# EAGLE design FPGA-ArduinoR3 (EAGLE 9.4.2)

## Sheet 1 of 5
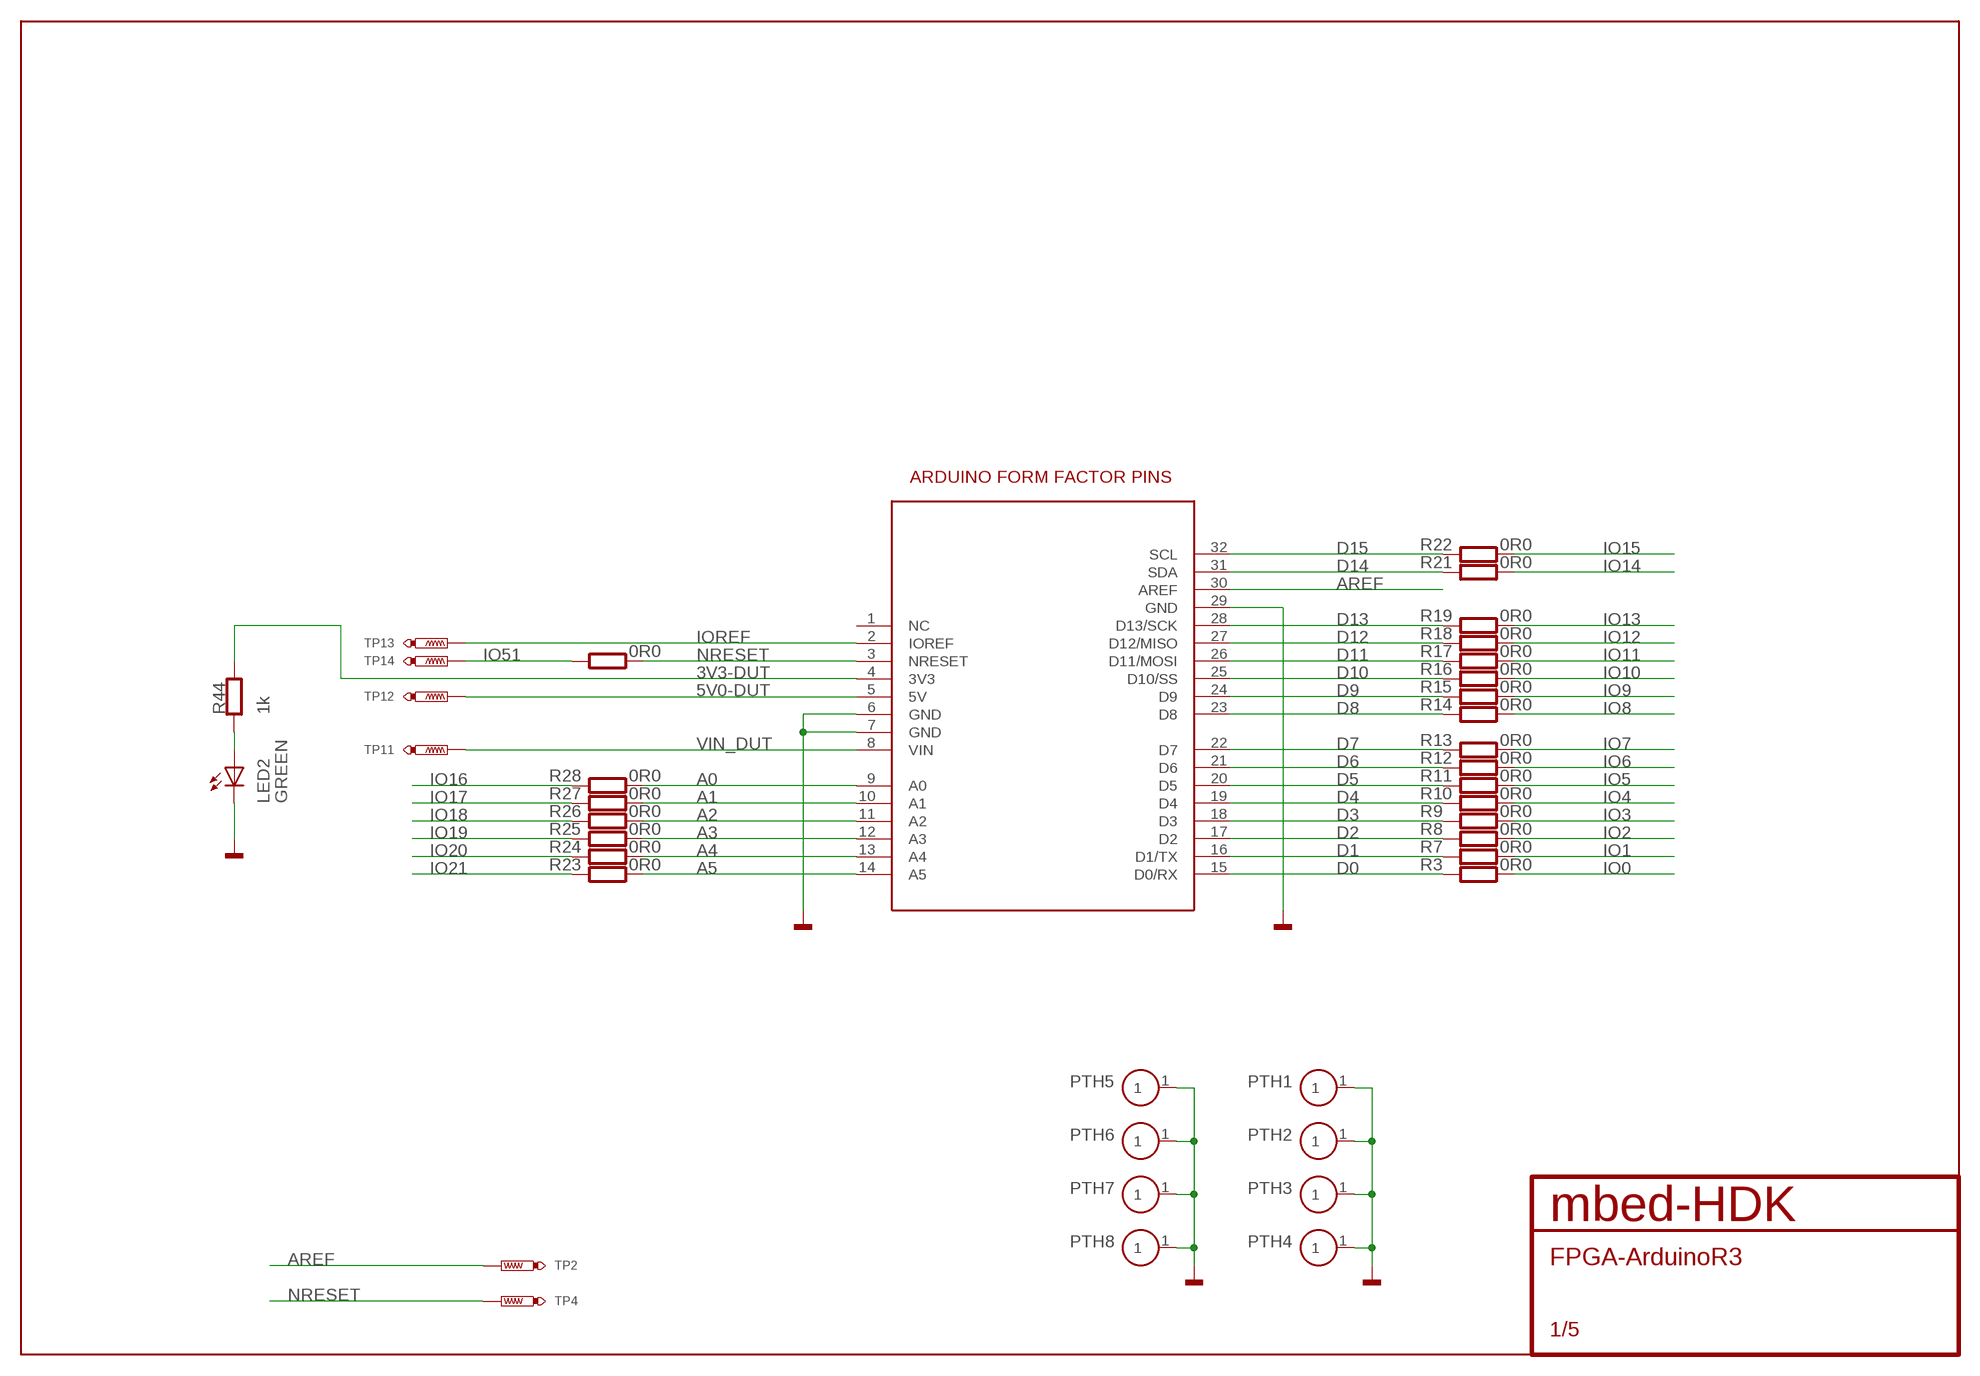
[diagram p0: schematic, sheet 1]

### Parts
BRD1  ARDUINO-R3_SILK  [ARDUINO-R3-SILK]
LED2  GREEN  LED0603  [CHIPLED_0603]
PTH1  FIXINGHOLE  [PTH-140-300]
PTH2  FIXINGHOLE  [PTH-140-300]
PTH3  FIXINGHOLE  [PTH-140-300]
PTH4  FIXINGHOLE  [PTH-140-300]
PTH5  FIXINGHOLE  [PTH-140-300]
PTH6  FIXINGHOLE  [PTH-140-300]
PTH7  FIXINGHOLE  [PTH-140-300]
PTH8  FIXINGHOLE  [PTH-140-300]
R2  0R0  R0603  [0603]
R3  0R0  R0603  [0603]
R7  0R0  R0603  [0603]
R8  0R0  R0603  [0603]
R9  0R0  R0603  [0603]
R10  0R0  R0603  [0603]
R11  0R0  R0603  [0603]
R12  0R0  R0603  [0603]
R13  0R0  R0603  [0603]
R14  0R0  R0603  [0603]
R15  0R0  R0603  [0603]
R16  0R0  R0603  [0603]
R17  0R0  R0603  [0603]
R18  0R0  R0603  [0603]
R19  0R0  R0603  [0603]
R21  0R0  R0603  [0603]
R22  0R0  R0603  [0603]
R23  0R0  R0603  [0603]
R24  0R0  R0603  [0603]
R25  0R0  R0603  [0603]
R26  0R0  R0603  [0603]
R27  0R0  R0603  [0603]
R28  0R0  R0603  [0603]
R44  1k  R0603  [0603]
TP2  TEST_POINT-50R-SMD  [TP50-SMD]
TP4  TEST_POINT-50R-SMD  [TP50-SMD]
TP11  TEST_POINT-50R-SMD  [TP50-SMD]
TP12  TEST_POINT-50R-SMD  [TP50-SMD]
TP13  TEST_POINT-50R-SMD  [TP50-SMD]
TP14  TEST_POINT-50R-SMD  [TP50-SMD]

### Nets
3V3-DUT: BRD1.4(3V3) R44.2
5V0-DUT: BRD1.5(5V) TP12.TP
A0: BRD1.9(A0) R28.1
A1: BRD1.10(A1) R27.1
A2: BRD1.11(A2) R26.1
A3: BRD1.12(A3) R25.1
A4: BRD1.13(A4) R24.1
A5: BRD1.14(A5) R23.1
AREF: BRD1.30(AREF) TP2.TP
D0: BRD1.15(D0/RX) R3.2
D1: BRD1.16(D1/TX) R7.2
D2: BRD1.17(D2) R8.2
D3: BRD1.18(D3) R9.2
D4: BRD1.19(D4) R10.2
D5: BRD1.20(D5) R11.2
D6: BRD1.21(D6) R12.2
D7: BRD1.22(D7) R13.2
D8: BRD1.23(D8) R14.2
D9: BRD1.24(D9) R15.2
D10: BRD1.25(D10/SS) R16.2
D11: BRD1.26(D11/MOSI) R17.2
D12: BRD1.27(D12/MISO) R18.2
D13: BRD1.28(D13/SCK) R19.2
D14: BRD1.31(SDA) R21.2
D15: BRD1.32(SCL) R22.2
GND: BRD1.6(GND) BRD1.7(GND) BRD1.29(GND) LED2.C PTH1.1 PTH2.1 PTH3.1 PTH4.1 PTH5.1 PTH6.1 PTH7.1 PTH8.1 ; also sheet 2,3,4,5
IO0: R3.1 ; also sheet 3,4
IO1: R7.1 ; also sheet 3,4
IO2: R8.1 ; also sheet 3,4
IO3: R9.1 ; also sheet 3,4
IO4: R10.1 ; also sheet 3,4
IO5: R11.1 ; also sheet 3,4
IO6: R12.1 ; also sheet 3,4
IO7: R13.1 ; also sheet 3,4
IO8: R14.1 ; also sheet 3,4
IO9: R15.1 ; also sheet 3,4
IO10: R16.1 ; also sheet 3,4
IO11: R17.1 ; also sheet 3,4
IO12: R18.1 ; also sheet 3,4
IO13: R19.1 ; also sheet 3,4
IO14: R21.1 ; also sheet 3,4
IO15: R22.1 ; also sheet 3,4
IO16: R28.2 ; also sheet 3,4
IO17: R27.2 ; also sheet 3,4
IO18: R26.2 ; also sheet 3,4
IO19: R25.2 ; also sheet 3,4
IO20: R24.2 ; also sheet 3,4
IO21: R23.2 ; also sheet 3,4
IO51: R2.2 TP14.TP ; also sheet 4
IOREF: BRD1.2(IOREF) TP13.TP
N$1: LED2.A R44.1
NRESET: BRD1.3(NRESET) R2.1 TP4.TP
VIN_DUT: BRD1.8(VIN) TP11.TP
Unconnected: BRD1.1(NC)

### Notes on the sheet
- ARDUINO FORM FACTOR PINS

## Sheet 2 of 5
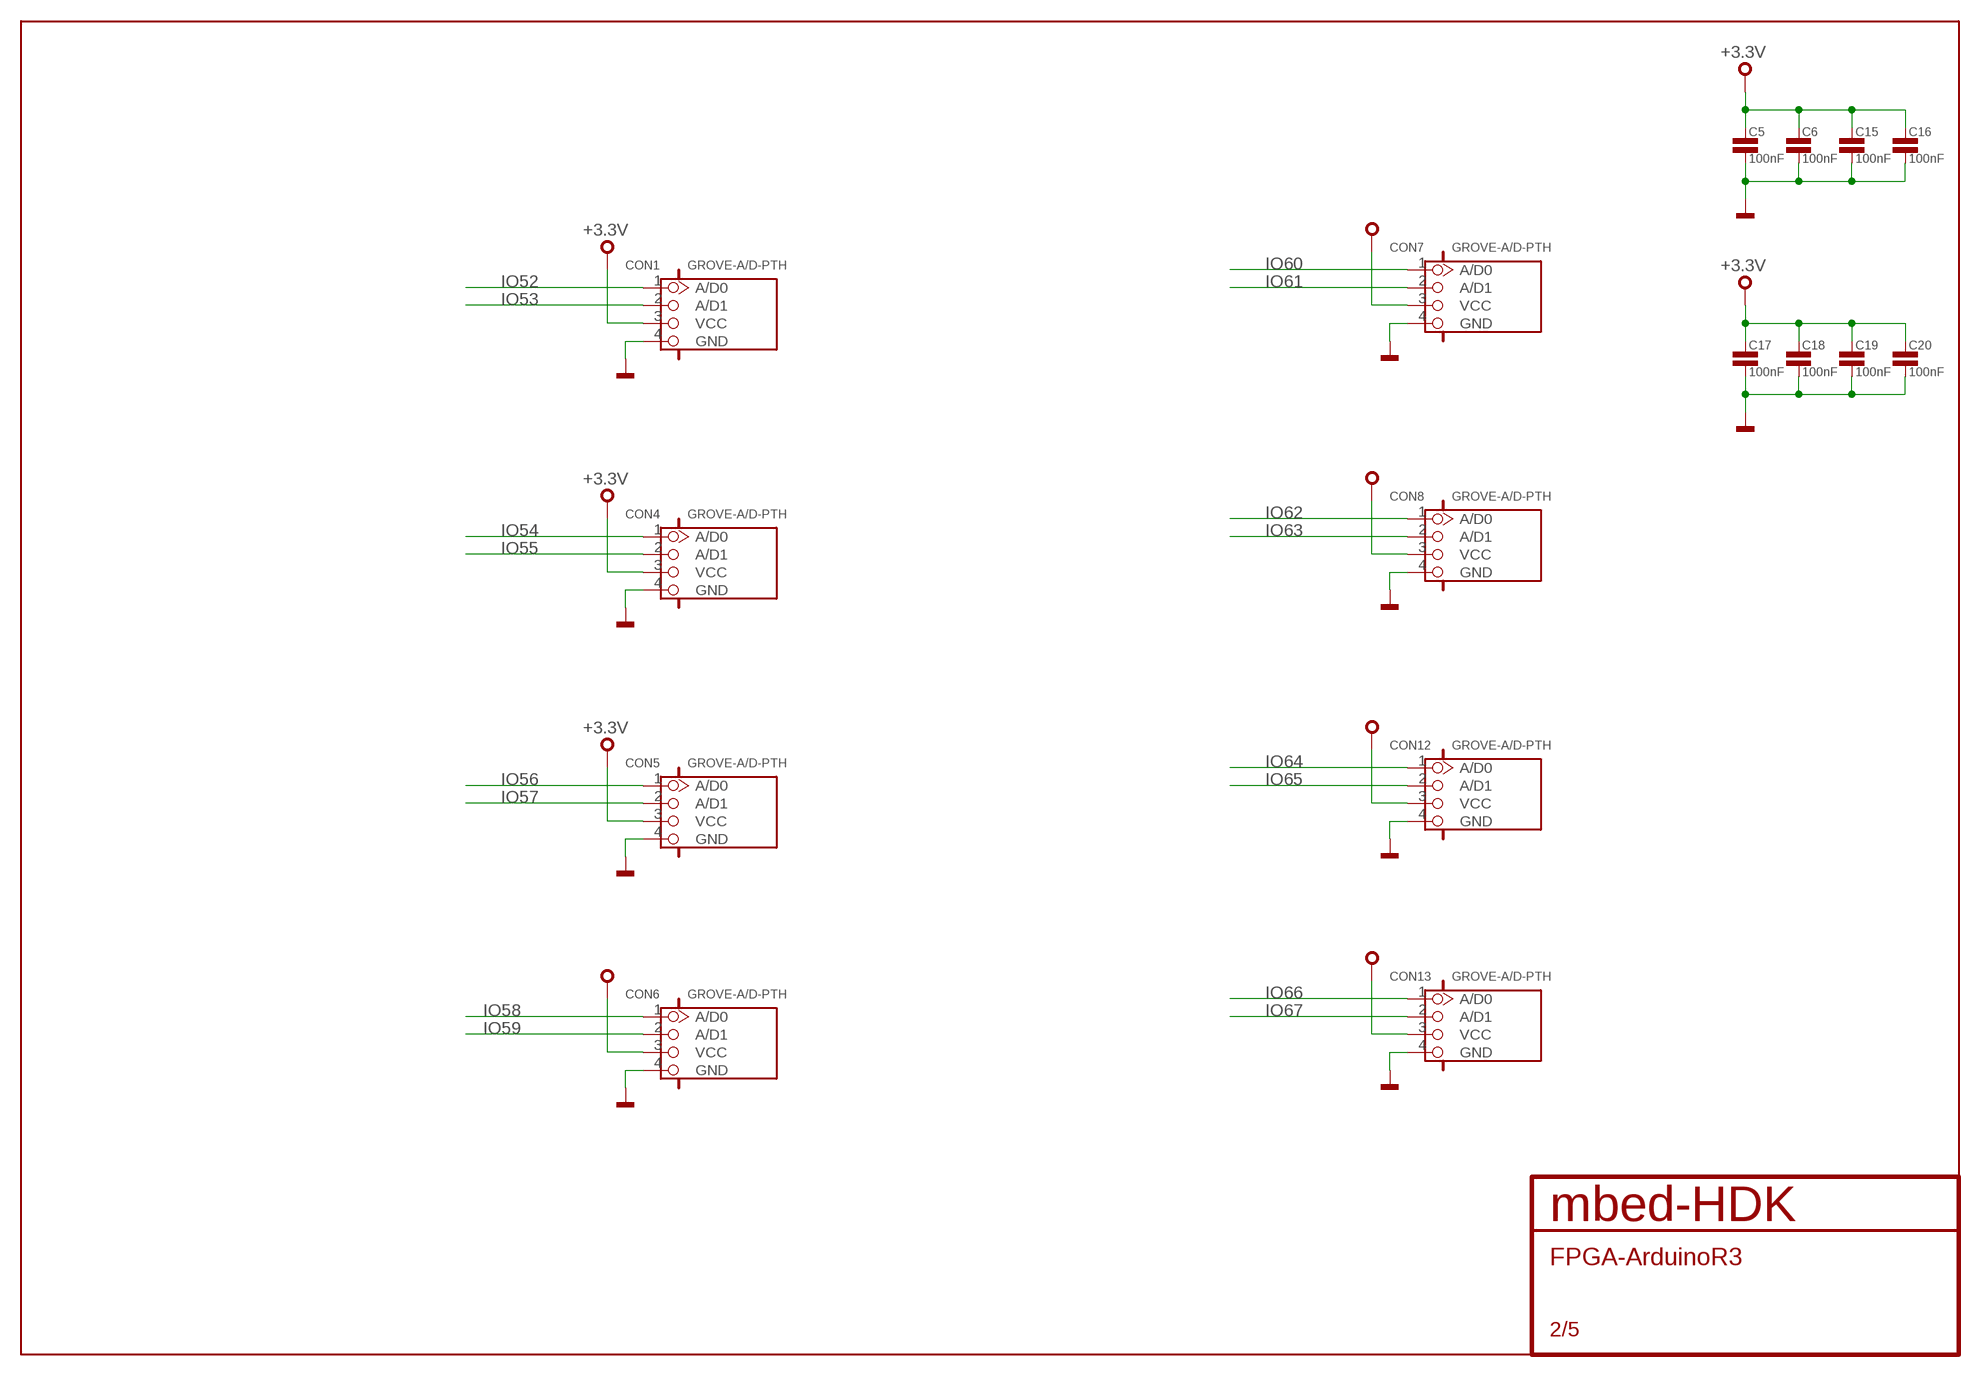
[diagram p1: schematic, sheet 2]

### Parts
C5  100nF  C0603  [0603]
C6  100nF  C0603  [0603]
C15  100nF  C0603  [0603]
C16  100nF  C0603  [0603]
C17  100nF  C0603  [0603]
C18  100nF  C0603  [0603]
C19  100nF  C0603  [0603]
C20  100nF  C0603  [0603]
CON1  GROVE-A/D-PTH  [HW4-2.0]
CON4  GROVE-A/D-PTH  [HW4-2.0]
CON5  GROVE-A/D-PTH  [HW4-2.0]
CON6  GROVE-A/D-PTH  [HW4-2.0]
CON7  GROVE-A/D-PTH  [HW4-2.0]
CON8  GROVE-A/D-PTH  [HW4-2.0]
CON12  GROVE-A/D-PTH  [HW4-2.0]
CON13  GROVE-A/D-PTH  [HW4-2.0]

### Nets
+3.3V: C5.1 C6.1 C15.1 C16.1 C17.1 C18.1 C19.1 C20.1 CON1.3(VCC) CON4.3(VCC) CON5.3(VCC) CON6.3(VCC) CON7.3(VCC) CON8.3(VCC) CON12.3(VCC) CON13.3(VCC) ; also sheet 3,4,5
GND: C5.2 C6.2 C15.2 C16.2 C17.2 C18.2 C19.2 C20.2 CON1.4(GND) CON4.4(GND) CON5.4(GND) CON6.4(GND) CON7.4(GND) CON8.4(GND) CON12.4(GND) CON13.4(GND) ; also sheet 1,3,4,5
IO52: CON1.1(A/D0) ; also sheet 3,4
IO53: CON1.2(A/D1) ; also sheet 3,4
IO54: CON4.1(A/D0) ; also sheet 3,4
IO55: CON4.2(A/D1) ; also sheet 3,4
IO56: CON5.1(A/D0) ; also sheet 3,4
IO57: CON5.2(A/D1) ; also sheet 3,4
IO58: CON6.1(A/D0) ; also sheet 3,4
IO59: CON6.2(A/D1) ; also sheet 3,4
IO60: CON7.1(A/D0) ; also sheet 3,4
IO61: CON7.2(A/D1) ; also sheet 3,4
IO62: CON8.1(A/D0) ; also sheet 3,4
IO63: CON8.2(A/D1) ; also sheet 3,4
IO64: CON12.1(A/D0) ; also sheet 3,5
IO65: CON12.2(A/D1) ; also sheet 3,5
IO66: CON13.1(A/D0) ; also sheet 3,5
IO67: CON13.2(A/D1) ; also sheet 3,5

## Sheet 3 of 5
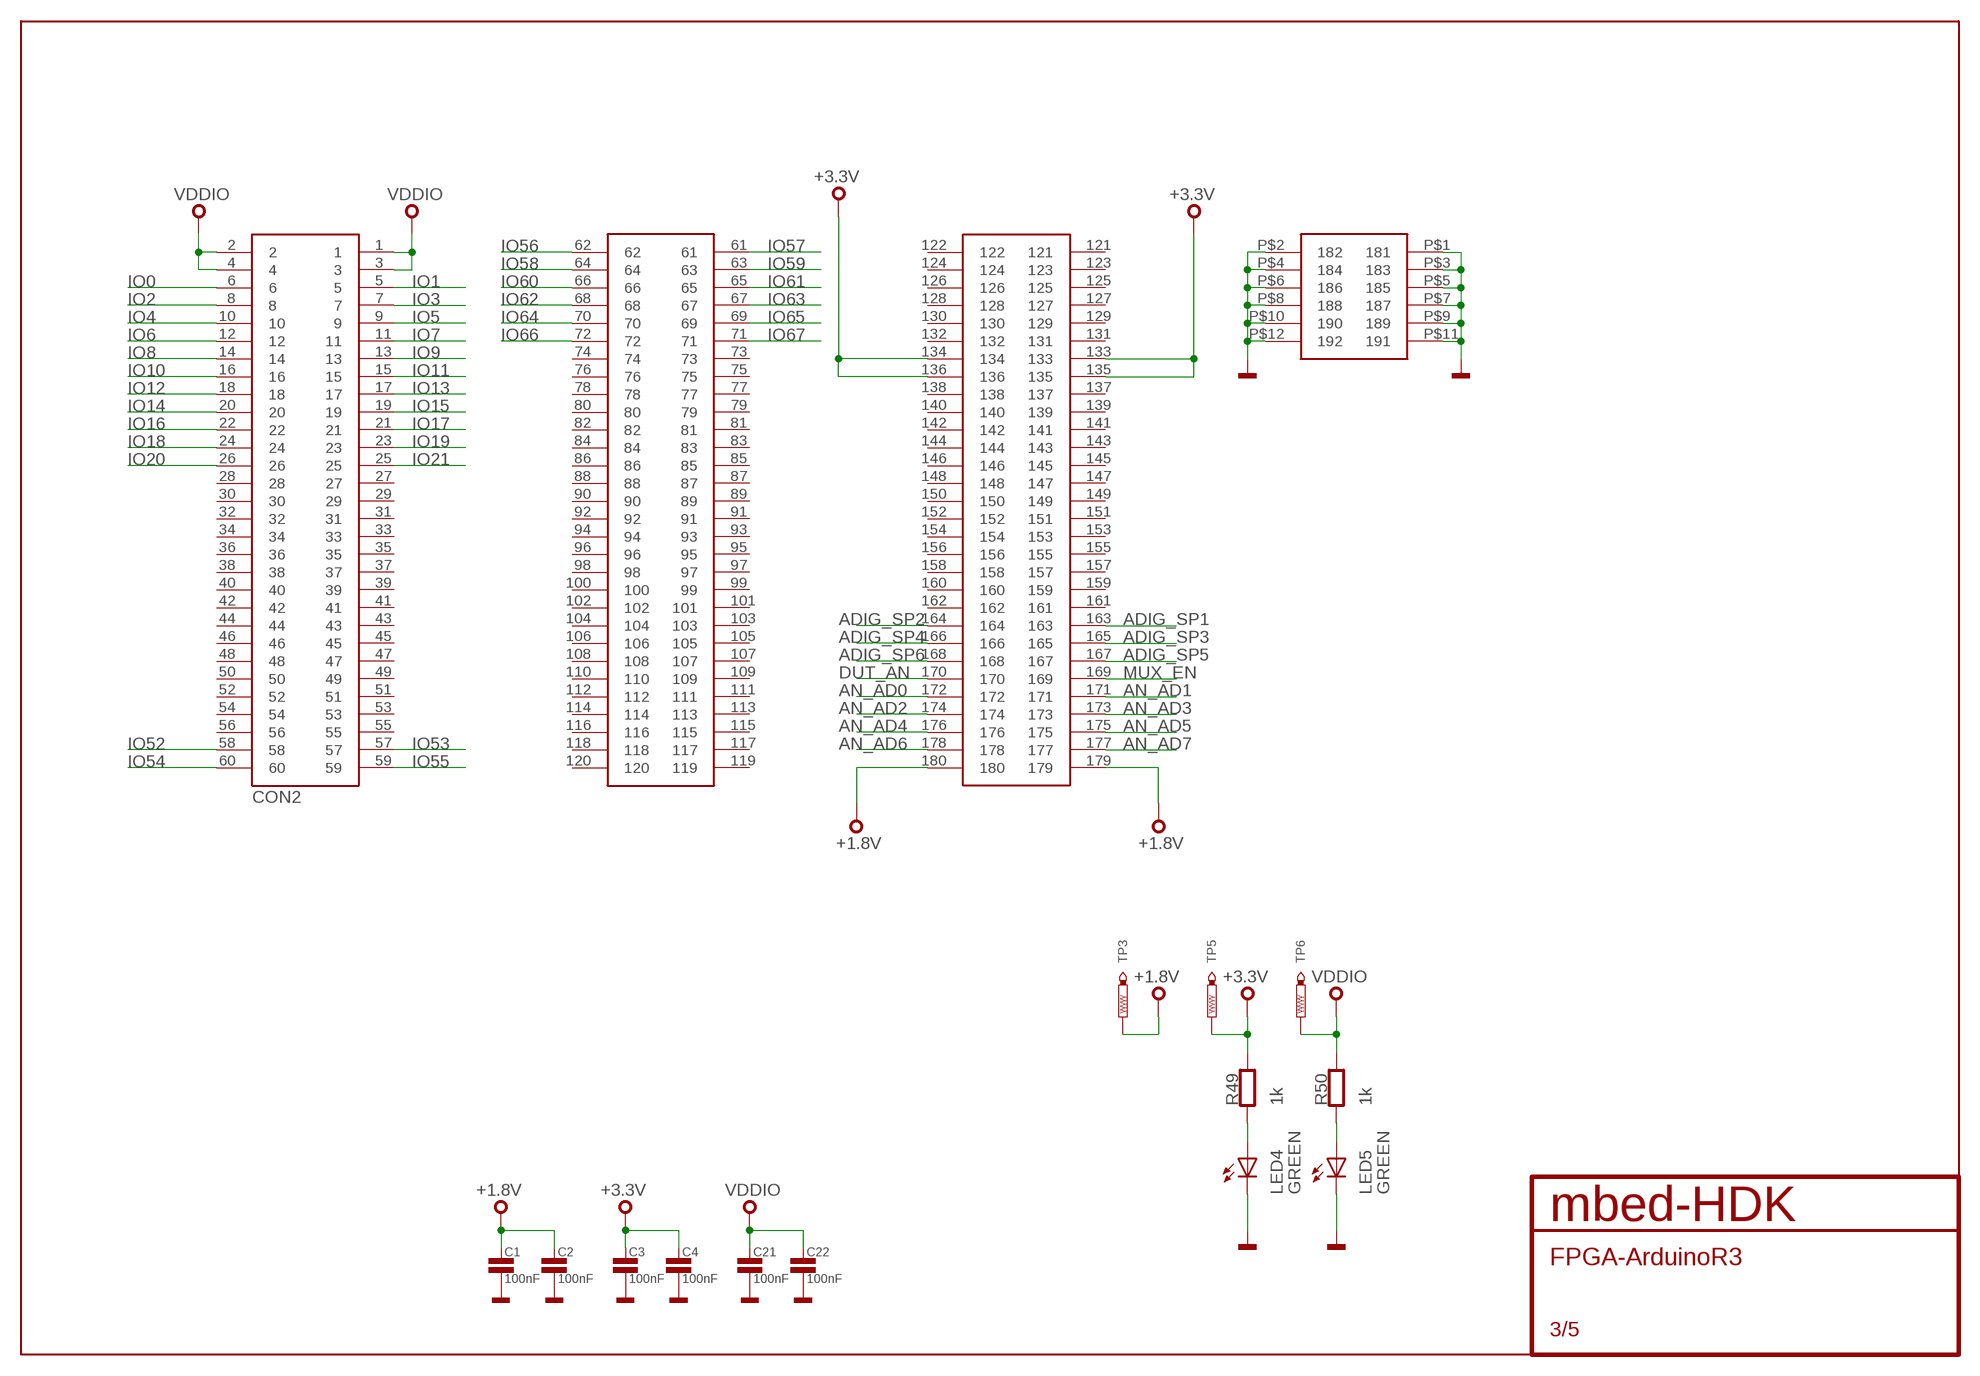
[diagram p2: schematic, sheet 3]

### Parts
C1  100nF  C0603  [0603]
C2  100nF  C0603  [0603]
C3  100nF  C0603  [0603]
C4  100nF  C0603  [0603]
C21  100nF  C0603  [0603]
C22  100nF  C0603  [0603]
CON2  QSH-090-01-L-D-A  [QSH-090-01-L-D-A]
LED4  GREEN  LED0603  [CHIPLED_0603]
LED5  GREEN  LED0603  [CHIPLED_0603]
R49  1k  R0603  [0603]
R50  1k  R0603  [0603]
TP3  TEST_POINT-50R-PTH  [TP50-PTH]
TP5  TEST_POINT-50R-PTH  [TP50-PTH]
TP6  TEST_POINT-50R-PTH  [TP50-PTH]

### Nets
+1.8V: C1.1 C2.1 CON2.179 CON2.180 TP3.TP ; also sheet 5
+3.3V: C3.1 C4.1 CON2.133 CON2.134 CON2.135 CON2.136 R49.2 TP5.TP ; also sheet 2,4,5
ADIG_SP1: CON2.163
ADIG_SP2: CON2.164
ADIG_SP3: CON2.165
ADIG_SP4: CON2.166
ADIG_SP5: CON2.167
ADIG_SP6: CON2.168
AN_AD0: CON2.172 ; also sheet 4,5
AN_AD1: CON2.171 ; also sheet 4,5
AN_AD2: CON2.174 ; also sheet 4,5
AN_AD3: CON2.173 ; also sheet 4,5
AN_AD4: CON2.176 ; also sheet 5
AN_AD5: CON2.175 ; also sheet 5
AN_AD6: CON2.178 ; also sheet 5
AN_AD7: CON2.177 ; also sheet 5
DUT_AN: CON2.170 ; also sheet 5
GND: C1.2 C2.2 C3.2 C4.2 C21.2 C22.2 CON2.P$1 CON2.P$2 CON2.P$3 CON2.P$4 CON2.P$5 CON2.P$6 CON2.P$7 CON2.P$8 CON2.P$9 CON2.P$10 CON2.P$11 CON2.P$12 LED4.C LED5.C ; also sheet 1,2,4,5
IO0: CON2.6 ; also sheet 1,4
IO1: CON2.5 ; also sheet 1,4
IO2: CON2.8 ; also sheet 1,4
IO3: CON2.7 ; also sheet 1,4
IO4: CON2.10 ; also sheet 1,4
IO5: CON2.9 ; also sheet 1,4
IO6: CON2.12 ; also sheet 1,4
IO7: CON2.11 ; also sheet 1,4
IO8: CON2.14 ; also sheet 1,4
IO9: CON2.13 ; also sheet 1,4
IO10: CON2.16 ; also sheet 1,4
IO11: CON2.15 ; also sheet 1,4
IO12: CON2.18 ; also sheet 1,4
IO13: CON2.17 ; also sheet 1,4
IO14: CON2.20 ; also sheet 1,4
IO15: CON2.19 ; also sheet 1,4
IO16: CON2.22 ; also sheet 1,4
IO17: CON2.21 ; also sheet 1,4
IO18: CON2.24 ; also sheet 1,4
IO19: CON2.23 ; also sheet 1,4
IO20: CON2.26 ; also sheet 1,4
IO21: CON2.25 ; also sheet 1,4
IO52: CON2.58 ; also sheet 2,4
IO53: CON2.57 ; also sheet 2,4
IO54: CON2.60 ; also sheet 2,4
IO55: CON2.59 ; also sheet 2,4
IO56: CON2.62 ; also sheet 2,4
IO57: CON2.61 ; also sheet 2,4
IO58: CON2.64 ; also sheet 2,4
IO59: CON2.63 ; also sheet 2,4
IO60: CON2.66 ; also sheet 2,4
IO61: CON2.65 ; also sheet 2,4
IO62: CON2.68 ; also sheet 2,4
IO63: CON2.67 ; also sheet 2,4
IO64: CON2.70 ; also sheet 2,5
IO65: CON2.69 ; also sheet 2,5
IO66: CON2.72 ; also sheet 2,5
IO67: CON2.71 ; also sheet 2,5
MUX_EN: CON2.169 ; also sheet 4,5
N$31: LED4.A R49.1
N$32: LED5.A R50.1
VDDIO: C21.1 C22.1 CON2.1 CON2.2 CON2.3 CON2.4 R50.2 TP6.TP ; also sheet 5
Unconnected: CON2.27 CON2.28 CON2.29 CON2.30 CON2.31 CON2.32 CON2.33 CON2.34 CON2.35 CON2.36 CON2.37 CON2.38 CON2.39 CON2.40 CON2.41 CON2.42 CON2.43 CON2.44 CON2.45 CON2.46 CON2.47 CON2.48 CON2.49 CON2.50 CON2.51 CON2.52 CON2.53 CON2.54 CON2.55 CON2.56 CON2.73 CON2.74 CON2.75 CON2.76 CON2.77 CON2.78 CON2.79 CON2.80 CON2.81 CON2.82 CON2.83 CON2.84 CON2.85 CON2.86 CON2.87 CON2.88 CON2.89 CON2.90 CON2.91 CON2.92 CON2.93 CON2.94 CON2.95 CON2.96 CON2.97 CON2.98 CON2.99 CON2.100 CON2.101 CON2.102 CON2.103 CON2.104 CON2.105 CON2.106 CON2.107 CON2.108 CON2.109 CON2.110 CON2.111 CON2.112 CON2.113 CON2.114 CON2.115 CON2.116 CON2.117 CON2.118 CON2.119 CON2.120 CON2.121 CON2.122 CON2.123 CON2.124 CON2.125 CON2.126 CON2.127 CON2.128 CON2.129 CON2.130 CON2.131 CON2.132 CON2.137 CON2.138 CON2.139 CON2.140 CON2.141 CON2.142 CON2.143 CON2.144 CON2.145 CON2.146 CON2.147 CON2.148 CON2.149 CON2.150 CON2.151 CON2.152 CON2.153 CON2.154 CON2.155 CON2.156 CON2.157 CON2.158 CON2.159 CON2.160 CON2.161 CON2.162

## Sheet 4 of 5
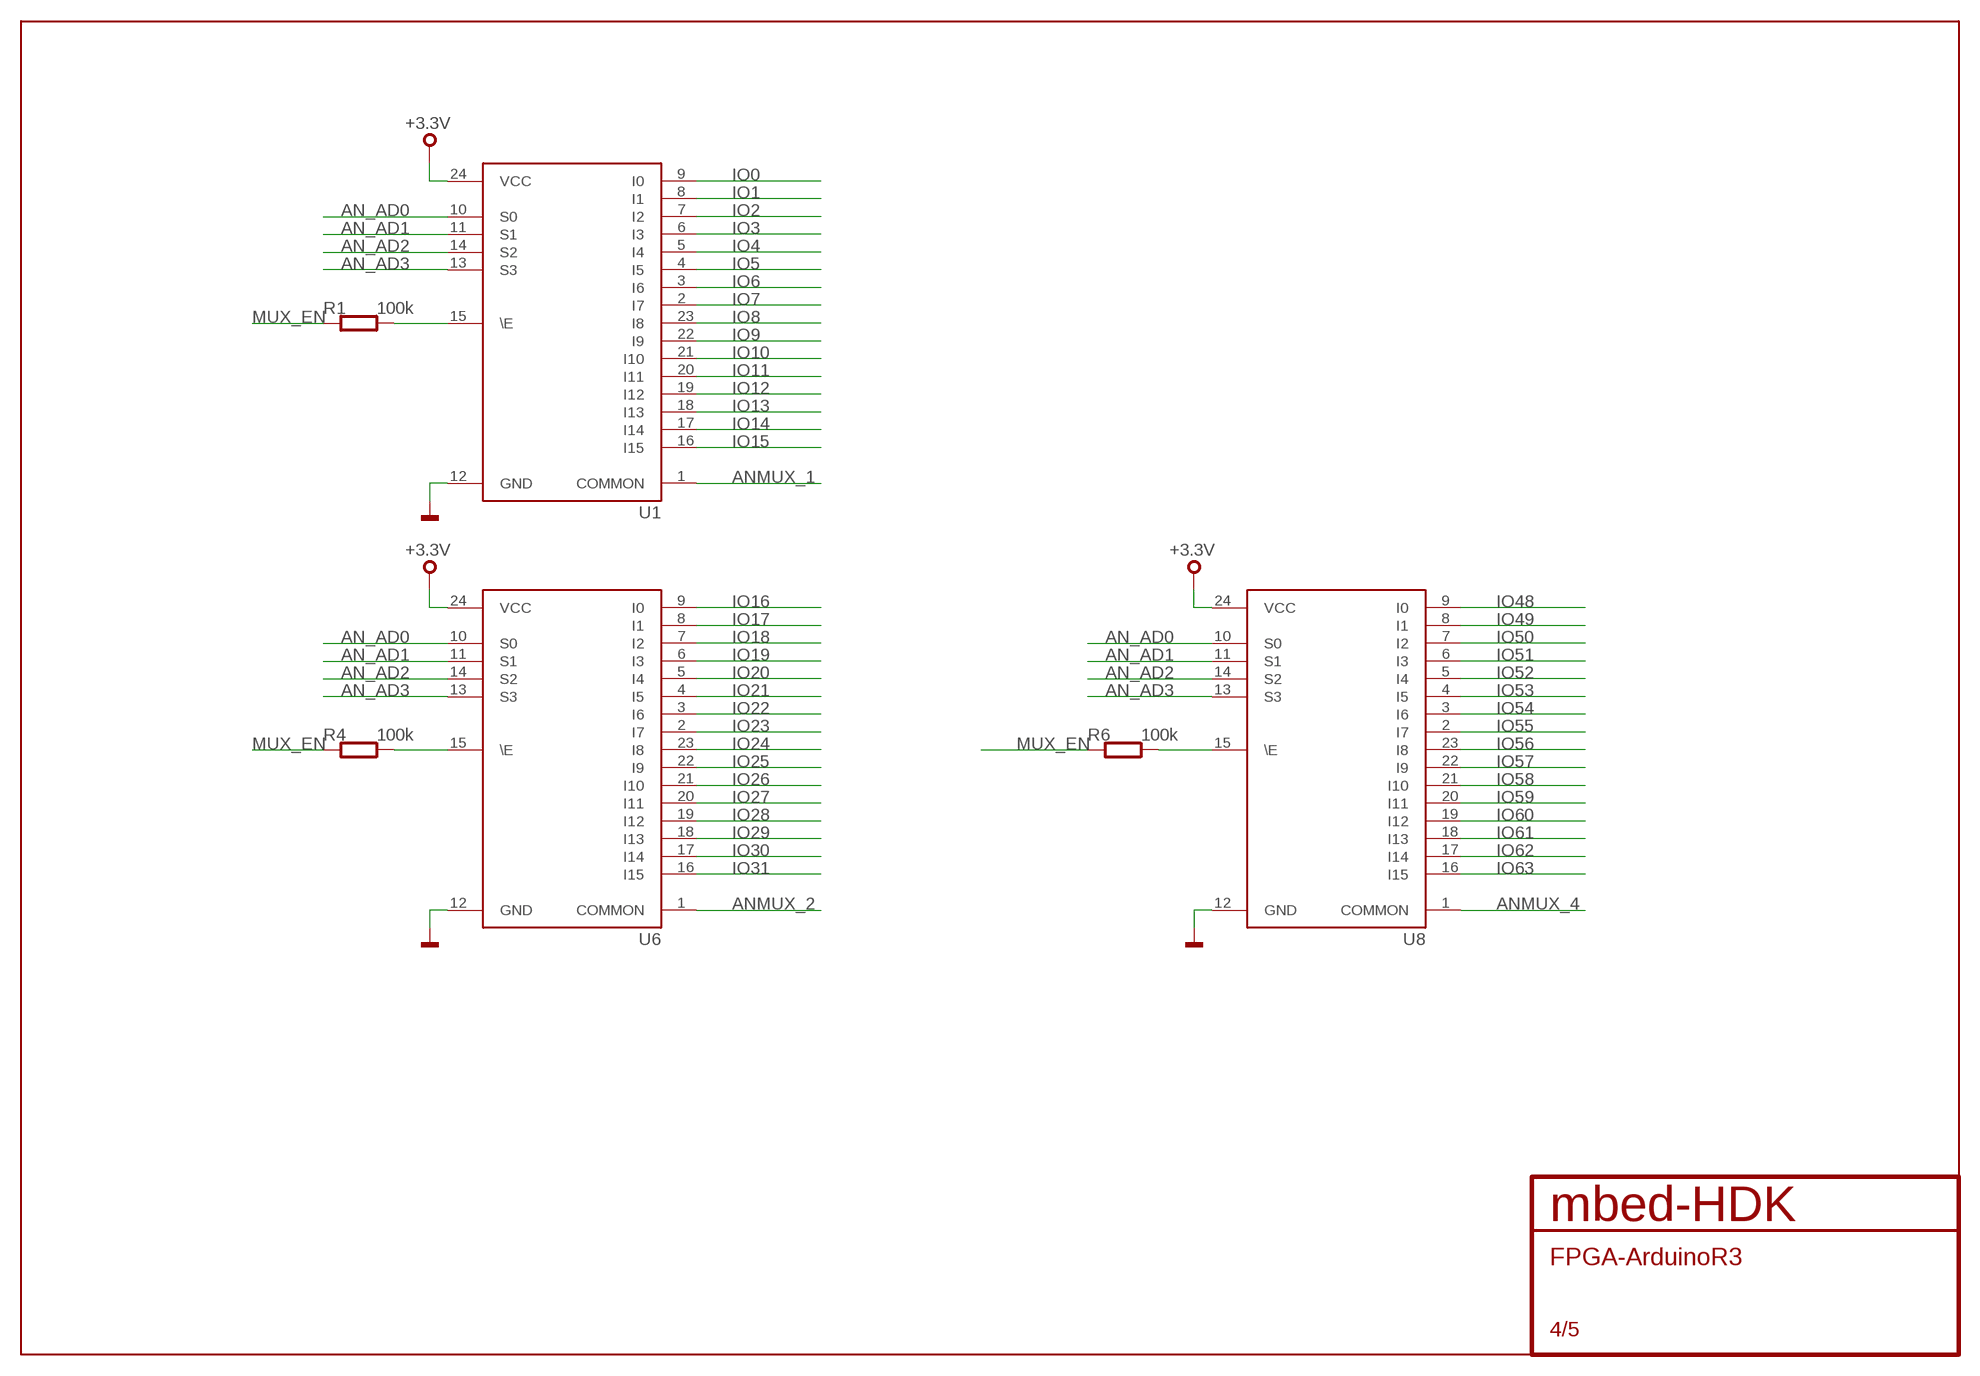
[diagram p3: schematic, sheet 4]

### Parts
R1  100k  R0603  [0603]
R4  100k  R0603  [0603]
R6  100k  R0603  [0603]
U1  CD74HCT4067  [SO24]
U6  CD74HCT4067  [SO24]
U8  CD74HCT4067  [SO24]

### Nets
+3.3V: U1.24(VCC) U6.24(VCC) U8.24(VCC) ; also sheet 2,3,5
AN_AD0: U1.10(S0) U6.10(S0) U8.10(S0) ; also sheet 3,5
AN_AD1: U1.11(S1) U6.11(S1) U8.11(S1) ; also sheet 3,5
AN_AD2: U1.14(S2) U6.14(S2) U8.14(S2) ; also sheet 3,5
AN_AD3: U1.13(S3) U6.13(S3) U8.13(S3) ; also sheet 3,5
ANMUX_1: U1.1(COMMON) ; also sheet 5
ANMUX_2: U6.1(COMMON) ; also sheet 5
ANMUX_4: U8.1(COMMON) ; also sheet 5
GND: U1.12(GND) U6.12(GND) U8.12(GND) ; also sheet 1,2,3,5
IO0: U1.9(I0) ; also sheet 1,3
IO1: U1.8(I1) ; also sheet 1,3
IO2: U1.7(I2) ; also sheet 1,3
IO3: U1.6(I3) ; also sheet 1,3
IO4: U1.5(I4) ; also sheet 1,3
IO5: U1.4(I5) ; also sheet 1,3
IO6: U1.3(I6) ; also sheet 1,3
IO7: U1.2(I7) ; also sheet 1,3
IO8: U1.23(I8) ; also sheet 1,3
IO9: U1.22(I9) ; also sheet 1,3
IO10: U1.21(I10) ; also sheet 1,3
IO11: U1.20(I11) ; also sheet 1,3
IO12: U1.19(I12) ; also sheet 1,3
IO13: U1.18(I13) ; also sheet 1,3
IO14: U1.17(I14) ; also sheet 1,3
IO15: U1.16(I15) ; also sheet 1,3
IO16: U6.9(I0) ; also sheet 1,3
IO17: U6.8(I1) ; also sheet 1,3
IO18: U6.7(I2) ; also sheet 1,3
IO19: U6.6(I3) ; also sheet 1,3
IO20: U6.5(I4) ; also sheet 1,3
IO21: U6.4(I5) ; also sheet 1,3
IO22: U6.3(I6)
IO23: U6.2(I7)
IO24: U6.23(I8)
IO25: U6.22(I9)
IO26: U6.21(I10)
IO27: U6.20(I11)
IO28: U6.19(I12)
IO29: U6.18(I13)
IO30: U6.17(I14)
IO31: U6.16(I15)
IO48: U8.9(I0)
IO49: U8.8(I1)
IO50: U8.7(I2)
IO51: U8.6(I3) ; also sheet 1
IO52: U8.5(I4) ; also sheet 2,3
IO53: U8.4(I5) ; also sheet 2,3
IO54: U8.3(I6) ; also sheet 2,3
IO55: U8.2(I7) ; also sheet 2,3
IO56: U8.23(I8) ; also sheet 2,3
IO57: U8.22(I9) ; also sheet 2,3
IO58: U8.21(I10) ; also sheet 2,3
IO59: U8.20(I11) ; also sheet 2,3
IO60: U8.19(I12) ; also sheet 2,3
IO61: U8.18(I13) ; also sheet 2,3
IO62: U8.17(I14) ; also sheet 2,3
IO63: U8.16(I15) ; also sheet 2,3
MUX_EN: R1.1 R4.1 R6.1 ; also sheet 3,5
N$4: R4.2 U6.15(\E)
N$10: R1.2 U1.15(\E)
N$11: R6.2 U8.15(\E)

## Sheet 5 of 5
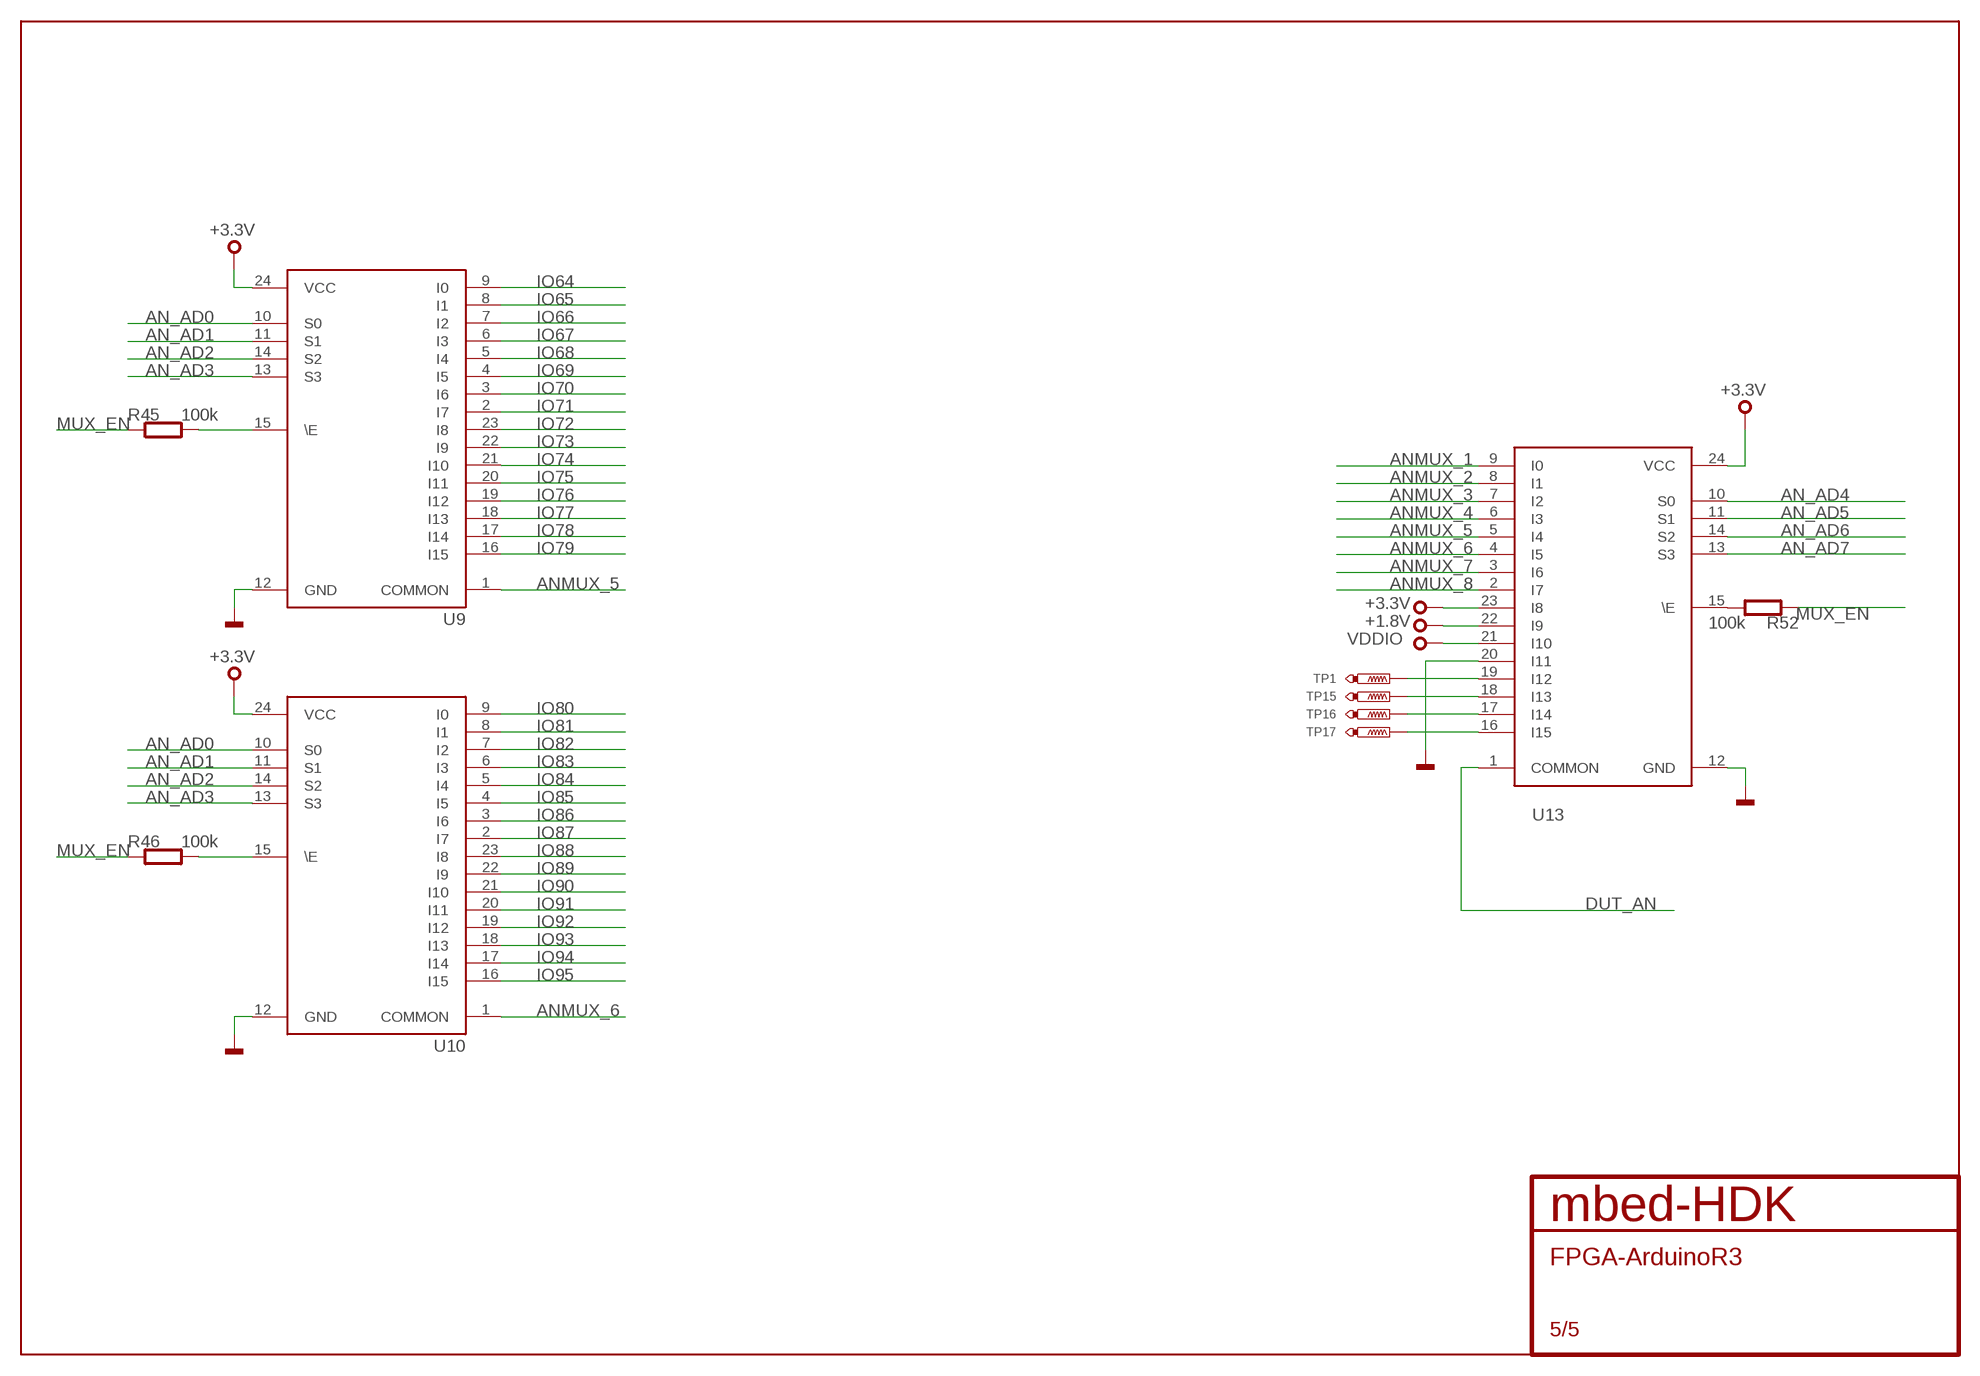
[diagram p4: schematic, sheet 5]

### Parts
R45  100k  R0603  [0603]
R46  100k  R0603  [0603]
R52  100k  R0603  [0603]
TP1  TEST_POINT-50R-PTH  [TP50-PTH]
TP15  TEST_POINT-50R-PTH  [TP50-PTH]
TP16  TEST_POINT-50R-PTH  [TP50-PTH]
TP17  TEST_POINT-50R-PTH  [TP50-PTH]
U9  CD74HCT4067  [SO24]
U10  CD74HCT4067  [SO24]
U13  CD74HCT4067  [SO24]

### Nets
+1.8V: U13.22(I9) ; also sheet 3
+3.3V: U9.24(VCC) U10.24(VCC) U13.23(I8) U13.24(VCC) ; also sheet 2,3,4
AN_AD0: U9.10(S0) U10.10(S0) ; also sheet 3,4
AN_AD1: U9.11(S1) U10.11(S1) ; also sheet 3,4
AN_AD2: U9.14(S2) U10.14(S2) ; also sheet 3,4
AN_AD3: U9.13(S3) U10.13(S3) ; also sheet 3,4
AN_AD4: U13.10(S0) ; also sheet 3
AN_AD5: U13.11(S1) ; also sheet 3
AN_AD6: U13.14(S2) ; also sheet 3
AN_AD7: U13.13(S3) ; also sheet 3
ANMUX_1: U13.9(I0) ; also sheet 4
ANMUX_2: U13.8(I1) ; also sheet 4
ANMUX_3: U13.7(I2)
ANMUX_4: U13.6(I3) ; also sheet 4
ANMUX_5: U9.1(COMMON) U13.5(I4)
ANMUX_6: U10.1(COMMON) U13.4(I5)
ANMUX_7: U13.3(I6)
ANMUX_8: U13.2(I7)
DUT_AN: U13.1(COMMON) ; also sheet 3
GND: U9.12(GND) U10.12(GND) U13.12(GND) U13.20(I11) ; also sheet 1,2,3,4
IO64: U9.9(I0) ; also sheet 2,3
IO65: U9.8(I1) ; also sheet 2,3
IO66: U9.7(I2) ; also sheet 2,3
IO67: U9.6(I3) ; also sheet 2,3
IO68: U9.5(I4)
IO69: U9.4(I5)
IO70: U9.3(I6)
IO71: U9.2(I7)
IO72: U9.23(I8)
IO73: U9.22(I9)
IO74: U9.21(I10)
IO75: U9.20(I11)
IO76: U9.19(I12)
IO77: U9.18(I13)
IO78: U9.17(I14)
IO79: U9.16(I15)
IO80: U10.9(I0)
IO81: U10.8(I1)
IO82: U10.7(I2)
IO83: U10.6(I3)
IO84: U10.5(I4)
IO85: U10.4(I5)
IO86: U10.3(I6)
IO87: U10.2(I7)
IO88: U10.23(I8)
IO89: U10.22(I9)
IO90: U10.21(I10)
IO91: U10.20(I11)
IO92: U10.19(I12)
IO93: U10.18(I13)
IO94: U10.17(I14)
IO95: U10.16(I15)
MUX_EN: R45.1 R46.1 R52.1 ; also sheet 3,4
N$12: R45.2 U9.15(\E)
N$13: R46.2 U10.15(\E)
N$18: R52.2 U13.15(\E)
N$19: TP1.TP U13.19(I12)
N$20: TP15.TP U13.18(I13)
N$21: TP16.TP U13.17(I14)
N$23: TP17.TP U13.16(I15)
VDDIO: U13.21(I10) ; also sheet 3

## Library data of the parts
BRD1 = mbed-HDK-misc-Board:ARDUINO-R3: Shield for Arduino R3
C1-C6 C15-C22 = mbed-HDK-RLC:C: Capacitor
CON1 CON4-CON8 CON12 CON13 = mbed-HDK-Connector:GROVE-A/D-PTH
CON2 = mbed-HDK-Connector:QSH-090-01-L-D-A; DIGIKEY-PN: SAM8182-ND
LED2 LED4 LED5 = mbed-HDK-Optical:LED: LED SMD
PTH1-PTH8 = mbed-HDK-misc-Board:FIXINGHOLE
R1-R4 R6-R19 R21-R28 R44-R46 R49 R50 R52 = mbed-HDK-RLC:R: Resistor
TP1-TP6 TP11-TP17 = mbed-HDK-Test:TEST_POINT
U1 U6 U8-U10 U13 = mbed-HDK-IC:CD74HCT4067

## Board
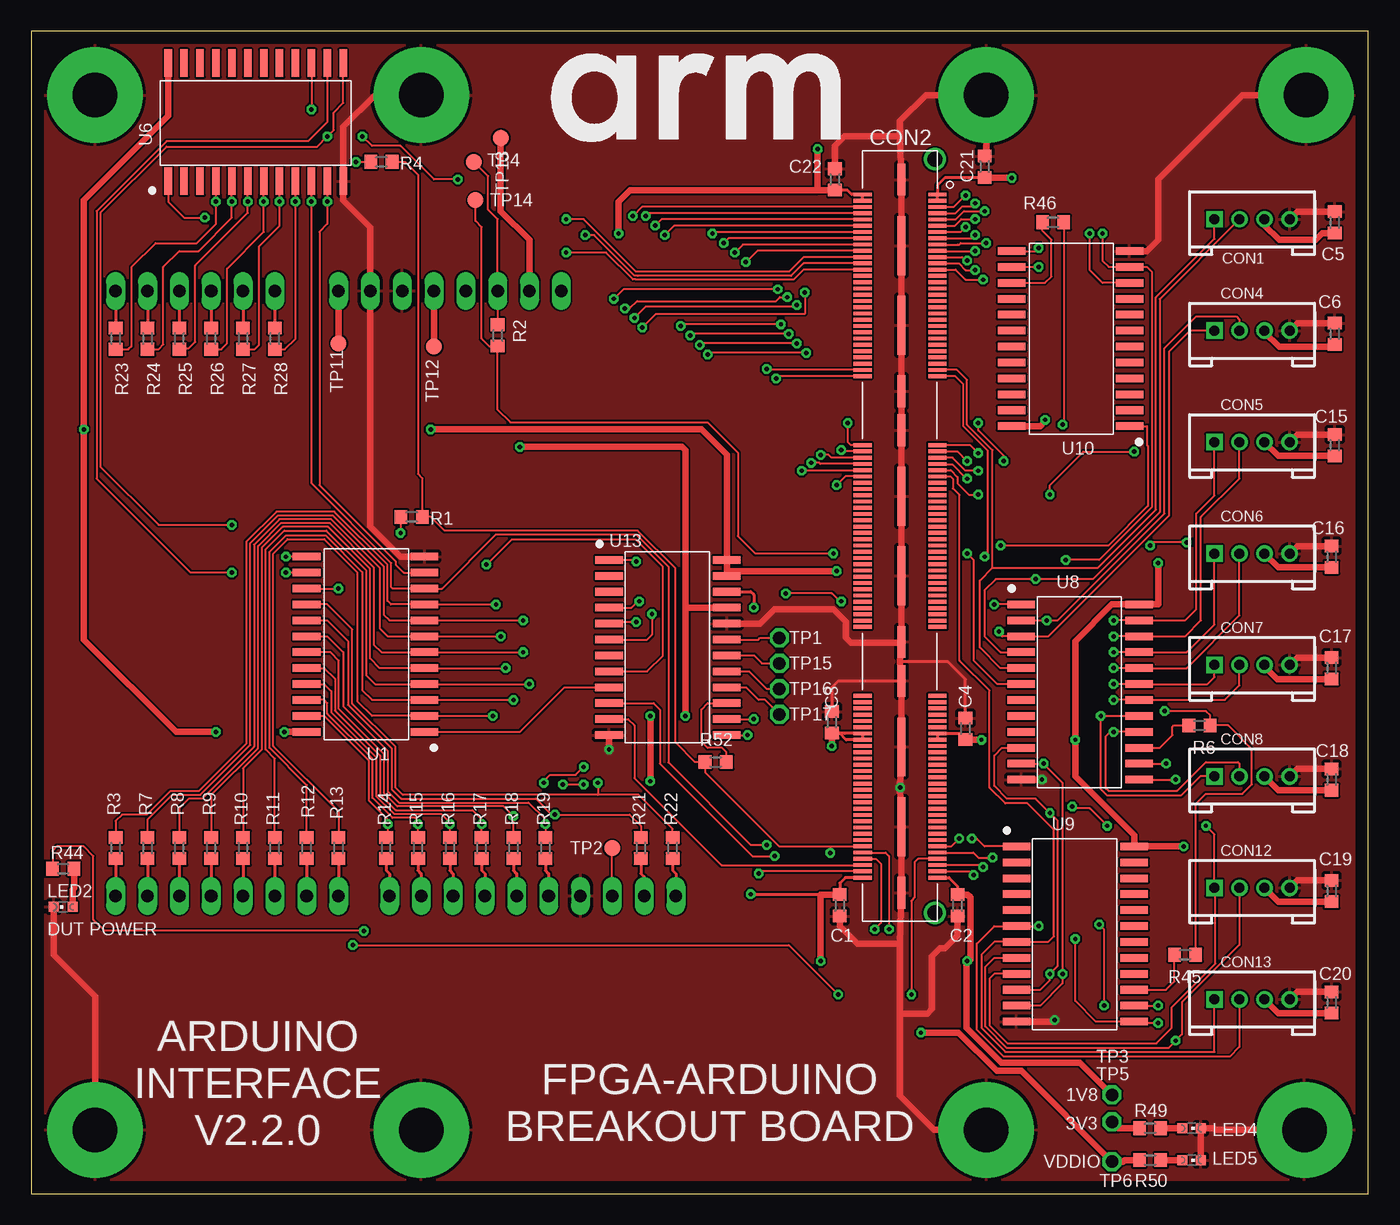
[diagram p5: board, top side]
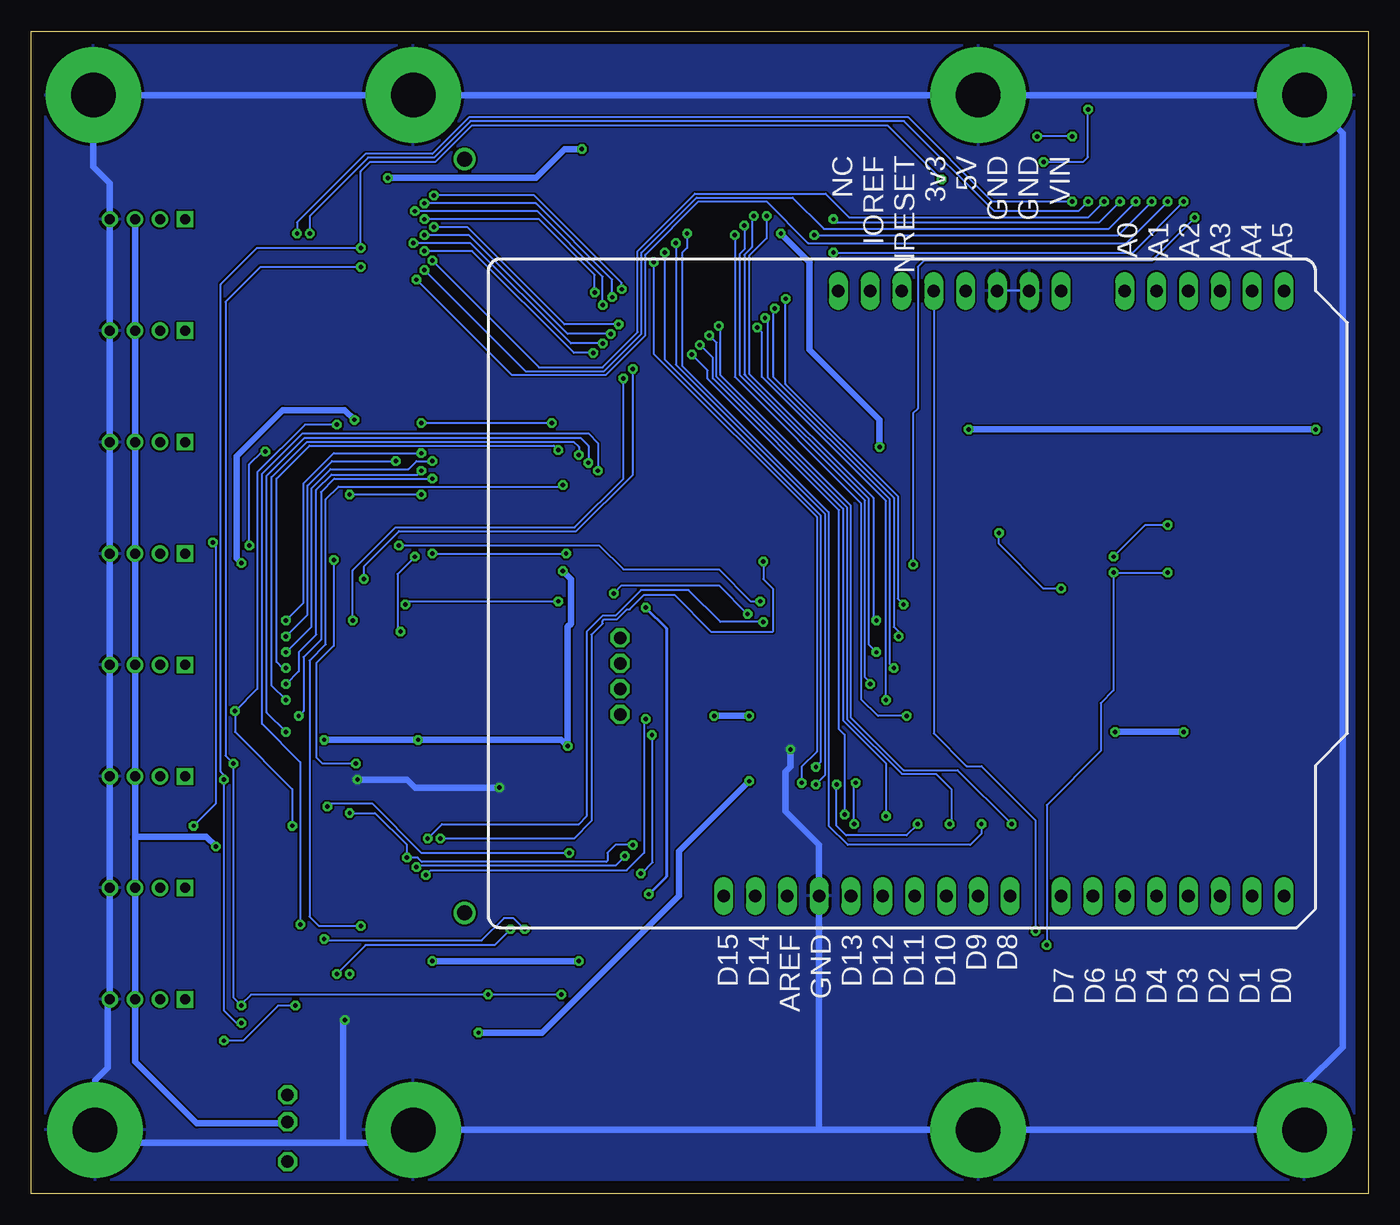
[diagram p6: board, bottom side, seen from below]

Size 106.68 x 92.71 mm. Coordinates in mm from the lower left corner, seen from the top.
Outline: 0,0 106.68,0 106.68,92.71 0,92.71 0,0
Copper layers (1*16): Top 0.035mm / dielectric 1.5mm / Bottom 0.035mm
Design rules "default": minimum track width 6mil, minimum drill 0.35mm, track to track 6mil, track to pad 6mil, pad to pad 6mil, via to via 6mil, smd to smd 6mil, copper to edge 40mil, drill to drill 6mil, minimum pad ring 10mil, minimum via ring 8mil, stop-mask expansion 4mil, vias tented up to drill 0mil, thermal gap 10mil

### Footprints (pad centres in the part's own frame; a part is rotated, then mirrored left to right if it is on the bottom)
ARDUINO-R3-SILK = drill 1 long: 1 27.94,2.54; 2 30.48,2.54; 3 33.02,2.54; 4 35.56,2.54; 5 38.1,2.54; 6 40.64,2.54; 7 43.18,2.54; 8 45.72,2.54; 9 50.8,2.54; 10 53.34,2.54; 11 55.88,2.54; 12 58.42,2.54; 13 60.96,2.54; 14 63.5,2.54; 15 63.5,50.8; 16 60.96,50.8; 17 58.42,50.8; 18 55.88,50.8; 19 53.34,50.8; 20 50.8,50.8; 21 48.26,50.8; 22 45.72,50.8; 23 41.656,50.8; 24 39.116,50.8; 25 36.576,50.8; 26 34.036,50.8; 27 31.496,50.8; 28 28.956,50.8; 29 26.416,50.8; 30 23.876,50.8; 31 21.336,50.8; 32 18.796,50.8
0603 = smd 1 x 1.1: 1 -0.85,0; 2 0.85,0
HW4-2.0 = drill 0.8 pad 1.27 square: 1 -3,0 | drill 0.8 pad 1.27: 2 -1,0; 3 1,0; 4 3,0
QSH-090-01-L-D-A = smd 0.305 x 1.45: 1 0,-5.969; 2 0,-0.001; 3 0.5,-5.969; 4 0.5,-0.001; 5 1,-5.969; 6 1,-0.001; 7 1.5,-5.969; 8 1.5,-0.001; 9 2,-5.969; 10 2,-0.001; 11 2.5,-5.969; 12 2.5,-0.001; 13 3,-5.969; 14 3,-0.001; 15 3.5,-5.969; 16 3.5,-0.001; 17 4,-5.969; 18 4,-0.001; 19 4.5,-5.969; 20 4.5,-0.001; 21 5,-5.969; 22 5,-0.001; 23 5.5,-5.969; 24 5.5,-0.001; 25 6,-5.969; 26 6,-0.001; 27 6.5,-5.969; 28 6.5,-0.001; 29 7,-5.969; 30 7,-0.001; 31 7.5,-5.969; 32 7.5,-0.001; 33 8,-5.969; 34 8,-0.001; 35 8.5,-5.969; 36 8.5,-0.001; 37 9,-5.969; 38 9,-0.001; 39 9.5,-5.969; 40 9.5,-0.001; 41 10,-5.969; 42 10,-0.001; 43 10.5,-5.969; 44 10.5,-0.001; 45 11,-5.969; 46 11,-0.001; 47 11.5,-5.969; 48 11.5,-0.001; 49 12,-5.969; 50 12,-0.001; 51 12.5,-5.969; 52 12.5,-0.001; 53 13,-5.969; 54 13,-0.001; 55 13.5,-5.969; 56 13.5,-0.001; 57 14,-5.969; 58 14,-0.001; 59 14.5,-5.969; 60 14.5,-0.001; 61 20,-5.969; 62 20,-0.001; 63 20.5,-5.969; 64 20.5,-0.001; 65 21,-5.969; 66 21,-0.001; 67 21.5,-5.969; 68 21.5,-0.001; 69 22,-5.969; 70 22,-0.001; 71 22.5,-5.969; 72 22.5,-0.001; 73 23,-5.969; 74 23,-0.001; 75 23.5,-5.969; 76 23.5,-0.001; 77 24,-5.969; 78 24,-0.001; 79 24.5,-5.969; 80 24.5,-0.001; 81 25,-5.969; 82 25,-0.001; 83 25.5,-5.969; 84 25.5,-0.001; 85 26,-5.969; 86 26,-0.001; 87 26.5,-5.969; 88 26.5,-0.001; 89 27,-5.969; 90 27,-0.001; 91 27.5,-5.969; 92 27.5,-0.001; 93 28,-5.969; 94 28,-0.001; 95 28.5,-5.969; 96 28.5,-0.001; 97 29,-5.969; 98 29,-0.001; 99 29.5,-5.969; 100 29.5,-0.001; 101 30,-5.969; 102 30,-0.001; 103 30.5,-5.969; 104 30.5,-0.001; 105 31,-5.969; 106 31,-0.001; 107 31.5,-5.969; 108 31.5,-0.001; 109 32,-5.969; 110 32,-0.001; 111 32.5,-5.969; 112 32.5,-0.001; 113 33,-5.969; 114 33,-0.001; 115 33.5,-5.969; 116 33.5,-0.001; 117 34,-5.969; 118 34,-0.001; 119 34.5,-5.969; 120 34.5,-0.001; 121 40,-5.969; 122 40,-0.001; 123 40.5,-5.969; 124 40.5,-0.001; 125 41,-5.969; 126 41,-0.001; 127 41.5,-5.969; 128 41.5,-0.001; 129 42,-5.969; 130 42,-0.001; 131 42.5,-5.969; 132 42.5,-0.001; 133 43,-5.969; 134 43,-0.001; 135 43.5,-5.969; 136 43.5,-0.001; 137 44,-5.969; 138 44,-0.001; 139 44.5,-5.969; 140 44.5,-0.001; 141 45,-5.969; 142 45,-0.001; 143 45.5,-5.969; 144 45.5,-0.001; 145 46,-5.969; 146 46,-0.001; 147 46.5,-5.969; 148 46.5,-0.001; 149 47,-5.969; 150 47,-0.001; 151 47.5,-5.969; 152 47.5,-0.001; 153 48,-5.969; 154 48,-0.001; 155 48.5,-5.969; 156 48.5,-0.001; 157 49,-5.969; 158 49,-0.001; 159 49.5,-5.969; 160 49.5,-0.001; 161 50,-5.969; 162 50,-0.001; 163 50.5,-5.969; 164 50.5,-0.001; 165 51,-5.969; 166 51,-0.001; 167 51.5,-5.969; 168 51.5,-0.001; 169 52,-5.969; 170 52,-0.001; 171 52.5,-5.969; 172 52.5,-0.001; 173 53,-5.969; 174 53,-0.001; 175 53.5,-5.969; 176 53.5,-0.001; 177 54,-5.969; 178 54,-0.001; 179 54.5,-5.969; 180 54.5,-0.001 | smd 2.54 x 0.64: P$1 15.7,-2.865; P$4 -1.19,-2.865; P$5 35.7,-2.865; P$8 18.81,-2.865; P$9 55.7,-2.865; P$12 38.81,-2.865 | smd 4.7 x 0.64: P$2 10.429,-2.865; P$3 4.079,-2.865; P$6 30.429,-2.865; P$7 24.079,-2.865; P$10 50.429,-2.865; P$11 44.079,-2.865 | drill 1.19 pad 1.19: P$15 -2.815,-0.195; P$18 57.315,-0.195
CHIPLED_0603 = smd 0.8 x 0.8: A 0,-0.75; C 0,0.75
PTH-140-300 = drill 3.556 pad 7.62: 1 0,0
TP50-PTH = drill 1 octagon: TP 0,0
TP50-SMD = smd 1.27 x 1.27: TP 0,0
SO24 = smd 0.6 x 2.2: 1 -6.985,-4.7; 2 -5.715,-4.7; 3 -4.445,-4.7; 4 -3.175,-4.7; 5 -1.905,-4.7; 6 -0.635,-4.7; 7 0.635,-4.7; 8 1.905,-4.7; 9 3.175,-4.7; 10 4.445,-4.7; 11 5.715,-4.7; 12 6.985,-4.7; 13 6.985,4.7; 14 5.715,4.7; 15 4.445,4.7; 16 3.175,4.7; 17 1.905,4.7; 18 0.635,4.7; 19 -0.635,4.7; 20 -1.905,4.7; 21 -3.175,4.7; 22 -4.445,4.7; 23 -5.715,4.7; 24 -6.985,4.7

### Placement (x,y rotation side)
BRD1  70.23,74.55 180 top
C1  64.52,22.99 270 top
C2  73.91,22.99 270 top
C3  63.88,37.59 90 top
C4  74.55,37.08 90 top
C5  104.01,77.47 90 top
C6  104.01,68.58 90 top
C15  104.01,59.69 90 top
C16  103.76,50.8 90 top
C17  103.76,41.91 90 top
C18  103.76,33.02 90 top
C19  103.76,24.13 90 top
C20  103.76,15.24 90 top
C21  76.07,81.92 90 top
C22  64.14,80.9 90 top
CON1  97.41,77.72 0 top
CON2  72.3,79.7 270 top
CON4  97.41,68.83 0 top
CON5  97.41,59.94 0 top
CON6  97.41,51.05 0 top
CON7  97.41,42.16 0 top
CON8  97.41,33.27 0 top
CON12  97.41,24.38 0 top
CON13  97.41,15.49 0 top
LED2  2.54,22.86 90 top
LED4  92.58,5.21 270 top
LED5  92.58,2.67 270 top
PTH1  76.2,87.63 0 top
PTH2  31.11,87.63 0 top
PTH3  31.11,5.08 0 top
PTH4  76.2,5.08 0 top
PTH5  101.73,87.63 0 top
PTH6  101.6,5.08 0 top
PTH7  5.08,87.63 0 top
PTH8  5.08,5.08 0 top
R1  30.35,53.98 180 top
R2  37.21,68.45 270 top
R3  6.73,27.56 270 top
R4  27.94,82.3 180 top
R6  93.22,37.34 180 top
R7  9.27,27.56 270 top
R8  11.81,27.56 270 top
R9  14.35,27.56 270 top
R10  16.89,27.56 270 top
R11  19.43,27.56 270 top
R12  21.97,27.56 270 top
R13  24.51,27.56 270 top
R14  28.32,27.56 270 top
R15  30.86,27.56 270 top
R16  33.4,27.56 270 top
R17  35.94,27.56 270 top
R18  38.48,27.56 270 top
R19  41.02,27.56 270 top
R21  48.64,27.56 270 top
R22  51.18,27.56 270 top
R23  6.73,68.2 270 top
R24  9.27,68.2 270 top
R25  11.81,68.2 270 top
R26  14.35,68.2 270 top
R27  16.89,68.2 270 top
R28  19.43,68.2 270 top
R44  2.54,25.91 180 top
R45  92.08,19.05 180 top
R46  81.53,77.47 180 top
R49  89.28,5.21 180 top
R50  89.28,2.67 180 top
R52  54.61,34.42 0 top
TP1  59.69,44.32 0 top
TP2  46.35,27.56 90 top
TP3  86.23,7.87 0 top
TP4  35.31,82.3 0 top
TP5  86.23,5.71 0 top
TP6  86.23,2.54 0 top
TP11  24.51,67.82 0 top
TP12  32.13,67.56 0 top
TP13  37.47,84.2 0 top
TP14  35.43,79.25 90 top
TP15  59.69,42.29 0 top
TP16  59.69,40.26 0 top
TP17  59.69,38.23 0 top
U1  26.67,43.81 90 top
U6  17.91,85.47 0 top
U8  83.69,40.01 270 top
U9  83.31,20.7 270 top
U10  82.93,68.2 90 top
U13  50.8,43.56 270 top

### Tracks (layer width: path | path; a pad name or v marks a point on that pad's centre or on a via)
3V3-DUT  (via drill 0.35)
  Top 0.152: v26.54,20.95 5.84,20.95 4.95,21.84 4.95,26.92 4.19,27.69 2.03,27.69 1.69,27.34 R44.2
  Bottom 0.152: BRD1.4 34.67,36.7 32.05,34.09 30.86,34.09 26.54,29.77 v26.54,20.95
5V0-DUT
  Top 0.508: TP12.TP BRD1.5
+1.8V  (via drill 0.35)
  Top 0.254: C2.1 73.91,24.51 73.22,25.2 CON2.180 | C1.1 64.52,24.77 64.95,25.2 CON2.179 | U13.22 57.4,48.01 57.66,47.75 v57.66,46.74 | v57.4,23.88 62.95,23.88 62.99,23.84
  Top 0.508: TP3.TP 83.67,10.44 77.4,10.44 74.63,13.21 74.63,18.54 | 74.63,18.54 74.63,18.67 74.93,18.67 74.93,23.62 74.72,23.84 C2.1 | C1.1 62.99,23.84 v62.99,18.54 | 74.63,18.54 v74.68,18.54
  Bottom 0.254: v57.66,46.74 56.01,45.09 56.01,25.27 v57.4,23.88
  Bottom 0.508: v62.99,18.54 v74.68,18.54
+3.3V  (via drill 0.35)
  Top 0.254: C3.1 63.92,36.71 64.51,36.71 | 64.51,36.71 64.9,36.71 64.9,36.7 CON2.133 CON2.135 65.02,36.2 64.51,36.71 | C4.1 74.08,36.7 CON2.134 CON2.136
  Top 0.508: U6.24 10.92,85.98 4.19,79.25 v4.19,60.96 4.19,44.2 11.56,36.83 v14.73,36.83 | U1.24 v20.19,36.83 | CON1.3 98.41,77.23 99.57,76.07 102.49,76.07 103.04,76.62 C5.1 | CON4.3 98.41,68.72 99.57,67.56 103.85,67.56 C6.1 | CON5.3 99.51,58.84 C15.1 | C16.1 99.51,49.95 CON6.3 | CON7.3 98.41,42.05 99.44,41.02 103.72,41.02 C17.1 | CON8.3 99.51,32.17 C18.1 | CON12.3 99.51,23.28 C19.1 | CON13.3 99.51,14.39 C20.1 | v91.95,27.69 U9.24 88.01,28.57 83.31,33.27 v83.31,36.2 83.31,44.07 86.23,46.99 U8.24 89.92,46.99 v89.92,50.29 | C3.1 v63.88,35.69 | v31.88,60.96 53.47,60.96 55.5,58.93 U13.24 U13.23 55.88,49.66 v64.26,49.66 | U10.24 80.52,61.21 80.9,61.6 v80.9,61.72 | TP5.TP 86.74,5.21 R49.2 | C4.1 74.59,36.2 v75.82,36.2
  Bottom 0.508: CON1.3 CON4.3 CON5.3 CON6.3 CON7.3 CON8.3 98.41,28.45 | 98.41,28.45 CON12.3 CON13.3 98.41,10.53 93.47,5.59 86.36,5.59 arc-90 TP5.TP | v14.73,36.83 v20.19,36.83 | 98.41,28.45 92.71,28.45 v91.95,27.69 | v83.31,36.2 v75.82,36.2 64.39,36.2 v63.88,35.69 63.88,45.21 63.63,45.47 63.63,49.02 v64.26,49.66 | v31.88,60.96 v4.19,60.96 | v89.92,50.29 90.3,50.67 90.3,58.8 86.61,62.48 81.66,62.48 v80.9,61.72
A0
  Top 0.254: BRD1.9 R28.1
A1
  Top 0.254: BRD1.10 R27.1
A2
  Top 0.254: BRD1.11 R26.1
A3
  Top 0.254: BRD1.12 R25.1
A4
  Top 0.254: BRD1.13 R24.1
A5
  Top 0.254: BRD1.14 R23.1
AN_AD0  (via drill 0.35)
  Top 0.152: U6.10 v22.35,79.12 22.35,56.66 28.73,50.29 28.73,48.36 28.83,48.26 U1.10 32.77,48.26 37.08,52.58 48.26,52.58 50.83,50.01 50.83,34.39 57.4,27.81 v58.67,27.81 | U10.10 85.47,72.64 84.45,73.66 v84.45,76.58 | U9.10 80.52,16.26 81.28,17.02 v81.28,17.53 81.92,18.16 81.92,29.72 v81.28,30.35 80.14,31.5 77.85,31.5 76.83,32.51 76.83,34.92 77.47,35.56 U8.10 | CON2.172 75.16,27.2 75.56,26.8 v76.71,26.8
  Bottom 0.152: v22.35,79.12 23.11,78.36 29.84,78.36 37.03,85.55 71.63,85.55 74.55,82.63 79.81,82.63 84.45,77.98 v84.45,76.58 | v58.67,27.81 60.07,27.81 60.71,27.18 60.71,26.54 60.78,26.47 75.52,26.47 75.85,26.8 v76.71,26.8 76.71,27.81 79.25,30.35 v81.28,30.35
AN_AD1  (via drill 0.35)
  Top 0.152: U6.11 v23.62,79.12 23.62,77.34 22.99,76.71 22.99,56.52 29.08,50.42 29.08,50.16 29.72,49.53 U1.11 | v85.47,76.58 85.47,74.42 85.98,73.91 U10.11 89.03,73.91 89.41,73.53 89.41,54.74 85.22,50.55 v82.55,50.55 | U8.11 v80.77,34.29 82.3,32.77 v82.3,17.53 82.3,16.76 80.52,14.99 U9.11 | CON2.171 68.18,27.2 68.45,26.92 v68.45,21.08
  Bottom 0.152: v23.62,79.12 29.97,79.12 36.7,85.85 71.75,85.85 74.68,82.93 80.01,82.93 85.47,77.47 v85.47,76.58 | v82.55,50.55 82.55,43.69 83.95,42.29 83.95,34.8 83.44,34.29 v80.77,34.29 | v68.45,21.08 69.72,19.81 80.01,19.81 v82.3,17.53
AN_AD2  (via drill 0.35)
  Top 0.152: U6.14 23.62,85.47 22.1,83.95 10.79,83.95 5.21,78.36 5.21,57.02 12.7,49.53 v16,49.53 | U1.14 v20.32,49.53 | U8.14 v90.55,34.29 | U9.14 v89.92,14.99 | U10.14 v80.39,73.91 | v25.65,19.81 60.45,19.81 v64.39,15.88 | CON2.174 70.77,26.7 70.48,26.42 70.48,23.62 70.21,23.35 70.21,15.89 v70.23,15.88
  Bottom 0.152: v16,49.53 v20.32,49.53 20.32,40.13 21.34,39.12 21.34,35.31 25.65,30.99 v25.65,19.81 | v80.39,73.91 88.39,73.91 91.19,71.12 91.19,34.92 v90.55,34.29 90.55,15.62 v89.92,14.99 89.92,15.11 89.15,15.88 v70.23,15.88 v64.39,15.88
AN_AD3  (via drill 0.35)
  Top 0.152: U1.13 v20.32,50.8 | v16,53.34 10.16,53.34 5.51,57.99 5.51,78.23 10.79,83.52 22.81,83.52 v23.62,84.33 24.13,84.84 24.13,86.23 24.89,87 U6.13 | U8.13 v91.31,33.02 | v89.92,13.59 88.14,13.59 U9.13 84.96,13.72 83.31,15.37 v83.31,20.32 | v80.39,75.44 80.14,75.18 U10.13 | v34.04,80.9 32.13,80.9 29.46,83.57 27.18,83.57 v26.42,84.33 | CON2.173 67.41,26.7 67.82,26.29 67.82,21.59 v67.31,21.08
  Bottom 0.152: v20.32,50.8 17.78,53.34 v16,53.34 | v89.92,13.59 90.3,13.59 91.31,14.61 v91.31,33.02 91.31,33.4 91.57,33.66 91.57,72.52 88.65,75.44 v80.39,75.44 80.39,81.53 79.63,82.3 74.42,82.3 71.5,85.22 38.35,85.22 v34.04,80.9 | v23.62,84.33 v26.42,84.33 | v67.31,21.08 68.2,21.97 68.96,21.97 70.74,20.19 83.19,20.19 v83.31,20.32
AN_AD4  (via drill 0.35)
  Top 0.152: U13.10 49.66,39.12 50.16,38.61 50.16,34.29 57.53,26.92 v59.31,26.92 | v75.95,26.04 75.78,26.2 CON2.176
  Bottom 0.152: v59.31,26.92 60.07,26.16 75.82,26.16 v75.95,26.04
AN_AD5
  Top 0.152: U13.11 47.62,37.85 48.13,37.34 48.13,33.15 55.08,26.2 CON2.175
AN_AD6  (via drill 0.35)
  Top 0.152: U13.14 v57.66,37.85 | CON2.178 74.88,25.7 v75.18,25.4
  Bottom 0.152: v75.18,25.4 74.8,25.78 59.18,25.78 57.78,27.18 57.78,37.72 v57.66,37.85
AN_AD7  (via drill 0.35)
  Top 0.152: U13.13 v57.15,36.58 | CON2.177 58.21,25.7 v58.04,25.53
  Bottom 0.152: v58.04,25.53 57.99,25.53 57.1,26.42 57.1,36.52 v57.15,36.58
ANMUX_1
  Top 0.152: U1.1 38.99,36.83 42.55,40.39 U13.9
ANMUX_2  (via drill 0.35)
  Top 0.152: U13.8 49.15,41.66 50.4,42.91 50.4,50.01 48.23,52.17 38.33,52.17 v36.32,50.16 | U6.1 10.92,79.12 12.19,77.85 v13.84,77.85
  Bottom 0.152: v36.32,50.16 36.32,62.23 35.94,62.61 35.94,73.91 35.43,74.42 17.27,74.42 v13.84,77.85
ANMUX_4  (via drill 0.35)
  Top 0.152: U13.6 49.15,44.2 49.53,44.58 v49.53,46.23 | U8.1 v76.83,46.99 | v64.64,47.24 64.52,47.24 63.88,47.88 v60.2,47.88
  Bottom 0.152: v76.83,46.99 76.58,47.24 v64.64,47.24 | v60.2,47.88 59.56,48.51 51.82,48.51 v49.53,46.23
ANMUX_5  (via drill 0.35)
  Top 0.152: U9.1 76.07,27.69 75.44,28.32 v75.06,28.32 | U13.5 46.23,45.59 v48.26,45.59
  Bottom 0.152: v75.06,28.32 73.91,29.46 62.99,29.46 62.36,30.1 62.36,44.83 61.09,46.1 60.07,46.1 58.04,48.13 54.23,48.13 51.69,45.59 v48.26,45.59
ANMUX_6  (via drill 0.35)
  Top 0.152: U13.4 47.88,46.74 48.39,47.24 v48.51,47.24 | U10.1 89.03,61.21 89.03,59.69 89.1,59.61 89.1,54.86 85.93,51.69 v77.34,51.69
  Bottom 0.152: v48.51,47.24 49.28,47.24 51.82,49.78 59.44,49.78 61.34,51.69 v77.34,51.69
AREF
  Top 0.152: BRD1.30 TP2.TP
D0
  Top 0.254: R3.2 BRD1.15
D1
  Top 0.254: R7.2 BRD1.16
D2
  Top 0.254: R8.2 BRD1.17
D3
  Top 0.254: R9.2 BRD1.18
D4
  Top 0.254: R10.2 BRD1.19
D5
  Top 0.254: R11.2 BRD1.20
D6
  Top 0.254: R12.2 BRD1.21
D7
  Top 0.254: R13.2 BRD1.22
D8
  Top 0.254: R14.2 28.32,25.78 28.57,25.53 BRD1.23
D9
  Top 0.254: R15.2 30.86,25.78 31.11,25.53 BRD1.24
D10
  Top 0.254: R16.2 33.4,25.78 33.66,25.53 BRD1.25
D11
  Top 0.254: R17.2 35.94,25.78 36.2,25.53 BRD1.26
D12
  Top 0.254: R18.2 38.48,25.78 38.73,25.53 BRD1.27
D13
  Top 0.254: R19.2 41.02,25.78 41.27,25.53 BRD1.28
D14
  Top 0.254: BRD1.31 48.9,25.27 48.64,25.53 R21.2
D15
  Top 0.254: BRD1.32 51.44,25.53 51.18,25.78 R22.2
DUT_AN  (via drill 0.35)
  Top 0.152: U13.1 48.13,50.55 v48.26,50.42 | CON2.170 73.42,27.7 v74.04,28.32
  Bottom 0.152: v48.26,50.42 48.26,49.02 47.5,48.26 47.5,44.83 52.45,44.83 55.37,47.75 57.78,47.75 58.93,46.61 59.13,46.61 59.95,45.8 60.96,45.8 61.09,45.67 61.09,45.47 61.98,44.58 61.98,29.72 63.37,28.32 v74.04,28.32
GND  (via drill 0.35)
  Top 0.254: C4.2 74.55,41.02 73.15,42.42 69.31,42.42 | C3.2 63.88,40.39 64.39,40.89 69.3,40.89 CON2.P$12
  Top 0.508: 69.31,84.33 CON2.P$4 CON2.P$3 CON2.P$2 CON2.P$1 CON2.P$8 CON2.P$7 CON2.P$6 CON2.P$5 | 69.31,84.33 69.31,85.56 71.37,87.63 PTH1.1 76.2,82.89 C21.2 | U1.12 29.46,50.8 27.05,53.21 BRD1.7 27.05,77.09 24.89,79.25 U6.12 24.89,85.09 27.43,87.63 PTH2.1 | CON2.P$5 69.31,42.42 CON2.P$12 CON2.P$11 69.31,32.38 | 69.31,32.38 CON2.P$10 CON2.P$9 69.31,19.94 | 69.31,19.94 69.31,14.35 | 69.31,14.35 69.31,7.78 72.01,5.08 PTH4.1 | v46.1,35.43 U13.12 | U10.12 89.03,75.18 89.92,76.07 89.92,80.9 96.65,87.63 PTH5.1 | C5.2 101,78.32 CON1.4 | CON4.4 101,69.43 C6.2 | CON5.4 101,60.54 C15.2 | CON6.4 101,51.65 C16.2 | CON7.4 101,42.76 C17.2 | CON8.4 101,33.87 C18.2 | CON12.4 101,24.98 C19.2 | CON13.4 101,16.09 C20.2 | C1.2 64.52,21.34 65.91,19.94 69.31,19.94 | U9.12 81.53,13.72 v81.66,13.84 | LED2.C 1.79,19.04 5.08,15.75 PTH8.1 | 69.31,32.38 v69.34,32.38 | v80.64,33.02 U8.12 | U13.20 58.17,45.47 59.31,46.61 64.01,46.61 65.02,45.59 65.02,44.32 65.41,43.94 69.25,43.94 CON2.P$5 | C22.2 64.14,83.57 64.9,84.33 69.31,84.33 | LED5.C LED4.C 94.36,5.21 94.49,5.08 PTH6.1 | 69.31,14.35 71.5,14.35 71.88,14.73 71.88,18.92 72.52,19.56 72.9,19.56 73.91,20.57 C2.2
  Bottom 0.152: BRD1.7 BRD1.6
  Bottom 0.508: 81.79,4.06 77.72,4.06 76.71,5.08 PTH4.1 43.69,5.08 | 81.79,4.06 85.73,4.06 85.75,4.05 100.57,4.05 PTH6.1 101.6,9.02 100.58,10.03 100.58,15.32 CON13.4 CON12.4 CON8.4 CON7.4 CON6.4 CON5.4 CON4.4 CON1.4 100.41,80.6 101.73,81.92 PTH5.1 PTH1.1 PTH2.1 PTH7.1 2.03,84.58 2.03,11.68 5.08,8.64 PTH8.1 PTH3.1 43.69,5.08 | v81.66,13.84 81.79,13.72 81.79,4.06 | v46.1,35.43 46.1,34.04 46.48,33.66 46.48,30.48 43.81,27.81 BRD1.29 43.81,5.21 43.69,5.08 | v69.34,32.38 76.07,32.38 76.71,33.02 v80.64,33.02
  pour Top: 0,0 0,92.54 106.75,92.54 106.75,0
  pour Bottom: 0,92.54 106.88,92.54 106.88,0 0,0
IO0  (via drill 0.35)
  Top 0.152: R3.1 6.73,29.72 7.24,30.23 9.22,30.23 11.1,32.11 13.36,32.11 17.14,35.89 17.14,51.99 19.56,54.41 24.18,54.41 28.42,50.16 28.42,47.27 28.7,46.99 U1.9 v37.08,46.99 | v59.56,72.14 47.24,72.14 v46.48,71.37 | CON2.6 73.62,78.7 v74.55,79.63
  Bottom 0.152: v37.08,46.99 37.54,47.45 37.54,55.62 46.48,64.57 v46.48,71.37 | v59.56,72.14 59.56,72.64 66.55,79.63 v74.55,79.63
IO1  (via drill 0.35)
  Top 0.152: R7.1 9.27,29.84 11.23,31.8 13.49,31.8 17.48,35.79 17.48,51.89 19.69,54.1 24.05,54.1 28.12,50.03 28.12,46.18 28.57,45.72 U1.8 v39.24,45.72 | CON2.5 48.77,78.7 48.77,78.74 v48.01,77.98
  Bottom 0.152: v39.24,45.72 39.5,45.97 39.5,55.5 49.4,65.41 49.4,74.8 48.01,76.2 v48.01,77.98
IO2  (via drill 0.35)
  Top 0.152: R8.1 11.81,30.73 12.57,31.5 13.62,31.5 17.78,35.66 17.78,51.76 19.82,53.8 23.92,53.8 27.81,49.91 27.81,45.09 28.45,44.45 U1.7 v37.47,44.45 | v47.37,70.61 47.75,70.61 48.34,71.2 59.44,71.2 59.74,71.5 v60.33,71.5 | CON2.8 73.76,78.2 74.3,78.74 75.06,78.74 v75.31,78.99
  Bottom 0.152: v37.47,44.45 37.47,44.83 37.85,45.21 37.85,55.5 47.45,65.1 47.45,70.54 v47.37,70.61 | v60.33,71.5 60.33,72.9 66.42,78.99 v75.31,78.99
IO3  (via drill 0.35)
  Top 0.152: v39.24,43.18 U1.6 27.94,43.18 27.33,43.79 27.33,49.96 23.8,53.49 19.94,53.49 18.09,51.64 18.09,35.53 14.35,31.8 R9.1 | CON2.7 49.24,78.2 v49.02,77.98
  Bottom 0.152: v39.24,43.18 39.85,43.79 39.85,55.42 49.68,65.25 49.78,65.36 49.78,74.88 49.18,75.49 49.18,77.82 v49.02,77.98
IO4  (via drill 0.35)
  Top 0.152: R10.1 16.89,33.91 18.39,35.41 18.39,51.51 20.07,53.19 23.67,53.19 27.03,49.83 27.03,42.7 27.81,41.91 U1.5 v37.85,41.91 | v48.13,69.85 49.05,70.76 60.98,70.76 v61.09,70.87 | CON2.10 73.76,77.7 74.42,78.36 v76.07,78.36
  Bottom 0.152: v37.85,41.91 38.18,42.24 38.18,55.37 47.88,65.07 47.88,69.6 v48.13,69.85 | v61.09,70.87 61.09,73.15 66.29,78.36 v76.07,78.36
IO5  (via drill 0.35)
  Top 0.152: R11.1 19.43,34.7 18.69,35.43 18.69,51.38 20.19,52.88 23.54,52.88 26.72,49.71 26.72,41.35 27.43,40.64 U1.4 v39.75,40.64 | CON2.9 50.27,77.7 v49.78,77.22
  Bottom 0.152: v39.75,40.64 39.75,40.77 40.16,41.17 40.16,55.29 50.16,65.31 50.16,74.93 49.78,75.31 v49.78,77.22
IO6  (via drill 0.35)
  Top 0.152: R12.1 21.97,32.59 19,35.56 19,51.18 20.32,52.5 23.49,52.5 26.42,49.58 26.42,40.13 27.18,39.37 U1.3 v38.48,39.37 | v48.77,69.09 49.86,70.18 61.72,70.18 v61.72,71.88 | CON2.12 73.69,77.2 74.22,77.72 v75.31,77.72
  Bottom 0.152: v38.48,39.37 38.48,55.24 48.39,65.15 48.39,68.71 v48.77,69.09 | v61.72,71.88 61.72,73.28 66.17,77.72 v75.31,77.72
IO7  (via drill 0.35)
  Top 0.152: R13.1 24.51,30.48 19.3,35.69 19.3,51.05 20.45,52.2 23.37,52.2 26.04,49.53 26.04,39.24 27.18,38.1 U1.2 v36.83,38.1 | CON2.11 51.29,77.2 v50.55,76.45
  Bottom 0.152: v36.83,38.1 39.12,38.1 40.46,39.44 40.46,55.06 50.55,65.15 v50.55,76.45
IO8  (via drill 0.35)
  Top 0.152: U1.23 23.37,38.1 26.92,34.54 26.92,31.37 28.45,29.84 v28.45,29.46 28.45,28.54 R14.1 | v59.82,69.34 51.94,69.34 v51.82,69.22 | CON2.14 72.31,76.71 74.17,76.71 v74.55,77.09
  Bottom 0.152: v28.45,29.46 32.77,33.78 37.08,33.78 41.27,37.97 41.27,54.86 51.69,65.28 51.69,69.09 v51.82,69.22 | v59.82,69.34 64.14,69.34 71.88,77.09 v74.55,77.09
IO9  (via drill 0.35)
  Top 0.152: R15.1 v30.86,29.46 30.86,29.72 30.61,29.97 28.83,29.97 27.23,31.57 27.23,34.67 23.62,38.28 23.62,39.12 23.37,39.37 U1.22 | CON2.13 54.48,76.7 v54.36,76.58
  Bottom 0.152: v30.86,29.46 30.86,28.7 31.75,27.81 41.53,27.81 43.05,29.34 43.05,54.36 54.74,66.04 54.74,75.06 54.36,75.44 v54.36,76.58
IO10  (via drill 0.35)
  Top 0.152: U1.21 23.37,40.64 23.93,40.08 23.93,38.4 27.53,34.8 27.53,31.7 28.95,30.28 32.72,30.28 33.4,29.59 v33.4,29.46 R16.1 | v60.45,68.58 52.7,68.58 v52.58,68.45 | CON2.16 75.06,76.2 v75.31,76.45
  Bottom 0.152: v33.4,29.46 33.27,29.59 33.27,32.26 34.49,33.48 37.21,33.48 41.58,37.85 41.58,54.74 51.99,65.15 51.99,67.87 v52.58,68.45 | v60.45,68.58 63.88,68.58 71.75,76.45 v75.31,76.45
IO11  (via drill 0.35)
  Top 0.152: U1.20 23.37,41.91 24.23,41.05 24.23,38.53 27.84,34.92 27.84,31.82 29.08,30.58 35.2,30.58 35.94,29.84 v35.94,29.46 R17.1 | v42.42,32.64 v44.07,32.64 | CON2.15 55.63,76.2 v55.24,75.82
  Bottom 0.152: v44.07,32.64 43.36,33.35 43.36,54.23 55.24,66.12 v55.24,75.82 | v35.94,29.46 36.83,28.57 41.66,28.57 42.42,29.34 v42.42,32.64
IO12  (via drill 0.35)
  Top 0.152: R18.1 v38.48,30.1 37.69,30.89 29.21,30.89 28.14,31.95 28.14,35.05 24.54,38.66 24.54,42.52 23.88,43.18 U1.19 | v61.09,67.82 53.47,67.82 v53.34,67.69 | CON2.18 73.91,75.7 73.91,75.69 74.04,75.69 74.17,75.82 v76.2,75.82
  Bottom 0.152: v38.48,30.1 38.48,34.32 41.91,37.75 41.91,54.64 52.3,65.03 52.3,66.67 53.31,67.69 v53.34,67.69 | v61.09,67.82 63.63,67.82 71.63,75.82 v76.2,75.82
IO13  (via drill 0.35)
  Top 0.152: U1.18 23.62,44.45 24.89,43.18 24.89,38.86 28.45,35.31 28.45,32.08 29.34,31.19 39.67,31.19 41.02,29.84 v41.02,29.46 R19.1 | v40.89,32.77 40.89,32.89 41.4,33.4 43.43,33.4 v44.07,34.04 | CON2.17 56.78,75.7 v56.13,75.06
  Bottom 0.152: v41.02,29.46 41.02,32.64 v40.89,32.77 | v44.07,34.04 43.69,34.42 43.69,54.1 56.13,66.55 v56.13,75.06
IO14  (via drill 0.35)
  Top 0.152: U1.17 23.62,45.72 25.27,44.07 25.27,38.99 28.75,35.51 28.75,32.26 29.52,31.5 40.26,31.5 41.53,30.23 v41.78,30.23 47.75,30.23 48.64,29.34 R21.1 | v61.85,67.06 54.1,67.06 v53.98,66.93 | CON2.20 72.32,75.18 v75.31,75.18
  Bottom 0.152: v41.78,30.23 41.78,36.6 42.22,37.03 42.22,54.51 52.7,65 52.7,65.66 v53.98,66.93 | v61.85,67.06 63.37,67.06 71.5,75.18 v75.31,75.18
IO15  (via drill 0.35)
  Top 0.152: R22.1 51.18,29.08 48.46,31.8 45.21,31.8 | 45.21,31.8 29.64,31.8 29.06,32.38 29.06,35.63 25.62,39.08 25.62,45 23.62,46.99 U1.16 | v45.21,32.77 45.21,31.8 | CON2.19 57.93,75.2 v57.02,74.3
  Bottom 0.152: v45.21,32.77 45.21,34.04 43.99,35.26 43.99,53.98 57.02,67.01 v57.02,74.3
IO16  (via drill 0.35)
  Top 0.152: R28.2 20.23,67.35 21.08,68.2 v21.08,79.12 U6.9 | CON2.22 74.27,74.7 74.55,74.42 v74.68,74.42
  Bottom 0.152: v21.08,79.12 22.35,77.85 41.4,77.85 43.31,79.76 53.72,79.76 58.29,75.18 58.29,68.71 61.09,65.91 66.17,65.91 v74.68,74.42
IO17  (via drill 0.35)
  Top 0.152: R27.2 17.82,67.35 18.16,67.69 18.16,75.56 19.81,77.22 v19.81,79.12 U6.8 | CON2.21 61.62,74.7 60.45,73.53 48.26,73.53 44.07,77.72 v42.67,77.72
  Bottom 0.152: v19.81,79.12 21.46,77.47 42.42,77.47 v42.67,77.72
IO18  (via drill 0.35)
  Top 0.152: R26.2 15.15,67.35 15.62,67.82 15.62,73.79 18.54,76.71 v18.54,79.12 U6.7 | CON2.24 74.01,74.2 74.55,73.66 v75.31,73.66
  Bottom 0.152: v18.54,79.12 20.7,76.96 43.43,76.96 45.92,79.45 53.59,79.45 57.99,75.06 57.99,68.58 60.96,65.61 67.26,65.61 v75.31,73.66
IO19  (via drill 0.35)
  Top 0.152: R25.2 11.9,67.44 12.57,67.44 13.08,67.94 13.08,74.04 17.27,78.23 v17.27,79.12 U6.6 | CON2.23 61.63,74.2 60.63,73.2 48.39,73.2 48.36,73.23 48.13,73.23 44.91,76.45 v44.2,76.45
  Bottom 0.152: v17.27,79.12 19.94,76.45 v44.2,76.45
IO20  (via drill 0.35)
  Top 0.152: U6.5 v16,79.12 16,77.85 13.34,75.18 11.81,75.18 10.54,73.91 10.54,67.73 10.16,67.35 R24.2 | CON2.26 73.75,73.7 74.55,72.9 v75.95,72.9
  Bottom 0.152: v16,79.12 19.3,75.82 44.7,75.82 48.03,79.15 53.44,79.15 57.68,74.91 57.68,68.45 60.83,65.3 68.35,65.3 v75.95,72.9
IO21  (via drill 0.35)
  Top 0.152: R23.2 7.75,67.35 8,67.6 8,73.91 9.91,75.82 13.21,75.82 14.73,77.34 v14.73,79.12 U6.4 | CON2.25 61.64,73.7 60.83,72.9 48.26,72.9 48.23,72.92 48.01,72.92 45.87,75.06 v42.67,75.06
  Bottom 0.152: v14.73,79.12 18.8,75.06 v42.67,75.06
IO51  (via drill 0.35)
  Top 0.152: TP14.TP 35.43,77.6 35.94,77.09 35.94,68.2 36.58,67.56 37.17,67.56 R2.2 37.21,62.52 38.23,61.51 53.98,61.51 56.39,59.09 56.39,52.45 57.78,51.05 v64.01,51.05 | U8.6 77.09,40.64 75.18,42.55 75.18,50.55 v74.68,51.05
  Bottom 0.152: v74.68,51.05 v64.01,51.05
IO52
  Top 0.152: U8.5 77.34,41.91 75.69,43.56 75.69,48.9 76.71,49.91 | 76.71,49.91 85.09,49.91 89.74,54.56 89.74,71.48 94.41,76.16 CON1.1 | 76.71,49.91 76.71,59.31 74.68,61.34 74.68,64.9 73.87,65.7 CON2.58
IO53  (via drill 0.35)
  Top 0.152: CON1.2 90.04,71.36 90.04,54.36 84.71,49.02 v80.14,49.02 76.96,49.02 76.07,48.13 76.07,44.45 77.34,43.18 U8.4 | v58.67,65.79 58.76,65.7 CON2.57
  Bottom 0.152: v80.14,49.02 80.14,50.04 77.34,52.83 63.2,52.83 58.67,57.35 v58.67,65.79
IO54  (via drill 0.35)
  Top 0.152: CON4.1 92.46,68.83 90.81,67.18 90.81,54.1 81.15,44.45 U8.3 77.47,44.45 77.22,44.7 v77.22,44.83 | v76.07,50.8 76.33,51.05 76.33,59.26 74.37,61.22 74.37,64.57 73.74,65.2 CON2.60
  Bottom 0.152: v77.22,44.83 77.47,45.09 77.47,49.4 v76.07,50.8
IO55  (via drill 0.35)
  Top 0.152: U8.2 v81.03,45.72 81.92,45.72 90.42,54.23 90.42,67.44 92.96,69.98 96.14,69.98 96.41,69.71 CON4.2 | CON2.59 59.61,65.2 v59.44,65.02
  Bottom 0.152: v81.03,45.72 81.03,49.71 77.6,53.14 63.32,53.14 59.44,57.02 v59.44,65.02
IO56  (via drill 0.35)
  Top 0.152: CON5.1 94.41,55.67 92.96,54.23 92.96,46.61 92.08,45.72 U8.23 v86.36,45.72 | v75.56,59.05 74.92,59.7 CON2.62
  Bottom 0.152: v86.36,45.72 84.96,47.12 84.96,56.64 82.55,59.05 v75.56,59.05
IO57  (via drill 0.35)
  Top 0.152: CON5.2 96.41,57.04 93.34,53.98 93.34,45.72 92.08,44.45 U8.22 v86.36,44.45 | v77.6,58.42 77.6,58.85 75.56,60.88 v75.56,61.47 | CON2.61 65.39,59.7 65.15,59.94 v65.15,61.47
  Bottom 0.152: v86.36,44.45 84.63,46.18 84.63,56.46 82.68,58.42 v77.6,58.42 | v75.56,61.47 v65.15,61.47
IO58  (via drill 0.35)
  Top 0.152: CON6.1 94.41,45.39 92.2,43.18 U8.21 v86.36,43.18 | CON2.64 73.89,59.2 v74.68,58.42
  Bottom 0.152: v86.36,43.18 84.33,45.21 84.33,56.26 82.8,57.78 76.58,57.78 75.95,58.42 v74.68,58.42
IO59  (via drill 0.35)
  Top 0.152: CON6.2 96.41,46.12 92.2,41.91 U8.20 v86.36,41.91 | CON2.63 64.75,59.2 v64.64,59.31
  Bottom 0.152: v86.36,41.91 86.61,41.91 87.12,42.42 87.12,57.02 84.48,59.66 65,59.66 v64.64,59.31
IO60  (via drill 0.35)
  Top 0.152: CON7.1 94.41,41.2 93.85,40.64 U8.19 v86.36,40.64 | v75.56,57.66 74.55,57.66 73.51,58.7 CON2.66
  Bottom 0.152: v86.36,40.64 85.34,41.66 85.34,43.18 83.95,44.58 83.95,56.13 82.73,57.35 75.87,57.35 v75.56,57.66
IO61  (via drill 0.35)
  Top 0.152: CON7.2 96.41,40.53 95.25,39.37 U8.18 v86.36,39.37 | CON2.65 63.85,58.7 63.63,58.93 v62.99,58.93
  Bottom 0.152: v86.36,39.37 87.5,40.51 87.5,57.15 84.68,59.97 63.4,59.97 62.99,59.56 v62.99,58.93
IO62  (via drill 0.35)
  Top 0.152: CON8.1 93.27,33.27 91.74,31.75 85.85,31.75 85.34,32.26 v85.34,38.1 U8.17 | CON2.68 72.34,58.17 73.48,58.17 74.63,57.02 v74.68,57.02
  Bottom 0.152: v85.34,38.1 84.96,38.48 84.96,42.8 83.57,44.2 83.57,55.96 82.5,57.02 v74.68,57.02
IO63  (via drill 0.35)
  Top 0.152: U8.16 v86.36,36.83 86.11,36.83 85.72,36.45 85.72,32.38 85.98,32.13 91.44,32.13 93.73,34.42 96.28,34.42 96.41,34.29 CON8.2 | CON2.67 62.96,58.2 62.87,58.29 v62.23,58.29
  Bottom 0.152: v86.36,36.83 87.88,38.35 87.88,57.28 84.89,60.27 62.87,60.27 62.23,59.64 v62.23,58.29
IO64  (via drill 0.35)
  Top 0.152: U9.9 76.83,17.53 76.45,17.14 76.45,13.44 77.9,11.99 89.79,11.99 91.01,13.21 91.01,14.86 94.49,18.34 94.49,24.3 CON12.1 94.41,28.65 v93.73,29.34 | CON2.70 73.36,57.7 73.91,57.15 73.91,56.64 74.8,55.75 v75.56,55.75 | v92.2,51.94 89.53,51.94 v89.28,51.69 | v81.28,55.75 81.28,56.52 83.95,59.18 v88.01,59.18
  Bottom 0.152: v93.73,29.34 91.95,31.11 91.95,51.69 v92.2,51.94 | v75.56,55.75 v81.28,55.75 | v89.28,51.69 89.28,58.17 88.27,59.18 v88.01,59.18
IO65  (via drill 0.35)
  Top 0.152: CON12.2 96.41,19.83 91.82,15.24 91.82,12.7 v91.31,12.19 90.73,11.61 77.85,11.61 76.12,13.33 76.12,18.09 76.83,18.8 U9.8 | v85.22,21.46 85.6,21.08 v85.6,14.99 | CON2.69 66.29,57.66 v61.47,57.66
  Bottom 0.152: v85.22,21.46 85.22,34.42 88.27,37.47 88.27,57.4 85.04,60.63 62.23,60.63 61.47,59.87 v61.47,57.66 | v85.6,14.99 87,14.99 89.79,12.19 v91.31,12.19
IO66
  Top 0.152: CON13.1 94.41,11.3 77.72,11.3 75.82,13.21 75.82,19.05 76.83,20.07 U9.7 81.15,20.07 81.61,20.52 81.61,29.01 79.5,31.11 77.72,31.11 76.45,32.38 76.45,40.13 74.07,42.52 74.07,55.73 73.53,56.26 73.53,57.02 73.36,57.2 CON2.72
IO67  (via drill 0.35)
  Top 0.152: CON13.2 96.41,11.7 95.63,10.92 77.6,10.92 75.44,13.08 75.44,19.94 76.83,21.34 U9.6 v80.39,21.34 | CON2.71 64.95,57.2 v64.26,56.52
  Bottom 0.152: v80.39,21.34 83.72,21.34 84.48,22.1 84.48,42.52 83.19,43.81 83.19,55.37 82.17,56.39 64.39,56.39 v64.26,56.52
IOREF
  Top 0.508: TP13.TP 37.47,78.36 39.75,76.07 BRD1.2
MUX_EN  (via drill 0.35)
  Top 0.152: R4.1 29.84,82.3 30.86,81.28 30.86,57.4 31.2,57.06 R1.1 31.88,53.98 32.97,52.88 48.39,52.88 51.39,49.88 51.39,35.99 52.96,34.42 R52.1 53.76,33.62 59.67,27.7 63.75,27.7 | R45.1 92.92,31.08 93.73,31.88 96.65,31.88 97.41,32.64 97.41,35.43 95.5,37.34 R6.1 94.07,38.14 93.73,38.48 v90.42,38.48 | R46.1 82.38,61.43 v82.3,61.34 | 63.75,27.7 CON2.169 | v85.85,29.34 84.45,30.73 83.19,30.73 v83.06,30.86 | v63.75,27.18 63.75,27.7
  Bottom 0.152: v82.3,61.34 84.84,61.34 88.65,57.53 88.65,40.26 v90.42,38.48 90.42,36.83 85.85,32.26 v85.85,29.34 | v83.06,30.86 82.8,31.11 79.5,31.11 75.56,27.18 v63.75,27.18
N$1
  Top 0.508: LED2.A 3.29,24.25 3.43,24.38 3.43,25.87 R44.1
N$4  (via drill 0.35)
  Top 0.152: U6.15 v22.35,86.49 | v25.91,82.3 R4.2
  Bottom 0.152: v25.91,82.3 22.73,82.3 22.35,82.68 v22.35,86.49
N$10  (via drill 0.35)
  Top 0.152: U1.15 v24.51,48.26 | R1.2 29.46,53.94 v29.46,52.7
  Bottom 0.152: v24.51,48.26 25.91,48.26 29.46,51.82 v29.46,52.7
N$11
  Top 0.152: U8.15 90.04,35.56 91.06,36.58 91.06,37.21 91.19,37.34 R6.2
N$12
  Top 0.152: U9.15 90.55,16.26 91.22,16.93 R45.2
N$13
  Top 0.152: R46.2 80.68,76.8 81.41,76.07 81.41,73.15 80.9,72.64 U10.15
N$18
  Top 0.152: R52.2 55.46,35.22 55.12,35.56 53.98,35.56 53.47,36.07 53.47,38.61 53.98,39.12 U13.15
N$19
  Top 0.152: U13.19 58.04,44.2 58.17,44.32 TP1.TP
N$20
  Top 0.152: U13.18 57.66,42.93 58.29,42.29 TP15.TP
N$21
  Top 0.152: U13.17 57.28,41.66 58.67,40.26 TP16.TP
N$23
  Top 0.152: U13.16 57.02,40.39 58.04,39.37 58.55,39.37 TP17.TP
N$31
  Top 0.508: R49.1 LED4.A
N$32
  Top 0.508: R50.1 LED5.A
NRESET
  Top 0.152: R2.1 BRD1.3 37.21,77.72 36.45,78.49 36.45,81.15 TP4.TP
VDDIO  (via drill 0.35)
  Top 0.254: CON2.3 CON2.1 65.46,79.7 65.11,80.05 C22.1 | C21.1 72.94,81.06 72.33,80.45 72.33,79.72 CON2.2 CON2.4
  Top 0.508: R50.2 87.25,2.67 87.12,2.54 TP6.TP 78.99,9.78 77.04,9.78 74,12.83 v70.99,12.83 | v49.4,38.1 v49.4,32.89 | U13.21 52.2,46.74 | 52.2,46.74 v52.2,38.1 | v78.23,81.03 76.11,81.03 C21.1 | C22.1 62.74,80.05 | 62.74,80.05 v62.74,83.31 | 52.2,46.74 52.2,59.31 51.94,59.56 v38.99,59.56 | v46.86,76.58 46.86,79.12 47.79,80.05 62.74,80.05
  Bottom 0.508: v70.99,12.83 65.91,12.83 54.99,23.75 54.99,27.3 v49.4,32.89 | v78.23,81.03 66.42,81.03 64.14,83.31 v62.74,83.31 | v49.4,38.1 v52.2,38.1 | v38.99,59.56 38.99,61.72 44.58,67.31 44.58,74.3 v46.86,76.58
VIN_DUT
  Top 0.508: TP11.TP BRD1.8

### Text on the board
tPlace: DUT POWER | ARDUINO / INTERFACE / V2.2.0 | FPGA-ARDUINO / BREAKOUT BOARD | 1V8 | 3V3 | VDDIO
bPlace: NC / IOREF / NRESET / 3v3 / 5V / GND / GND / VIN | A0 / A1 / A2 / A3 / A4 / A5 | D15 / D14 / AREF / GND / D13 / D12 / D11 / D10 / D9 / D8 | D7 / D6 / D5 / D4 / D3 / D2 / D1 / D0